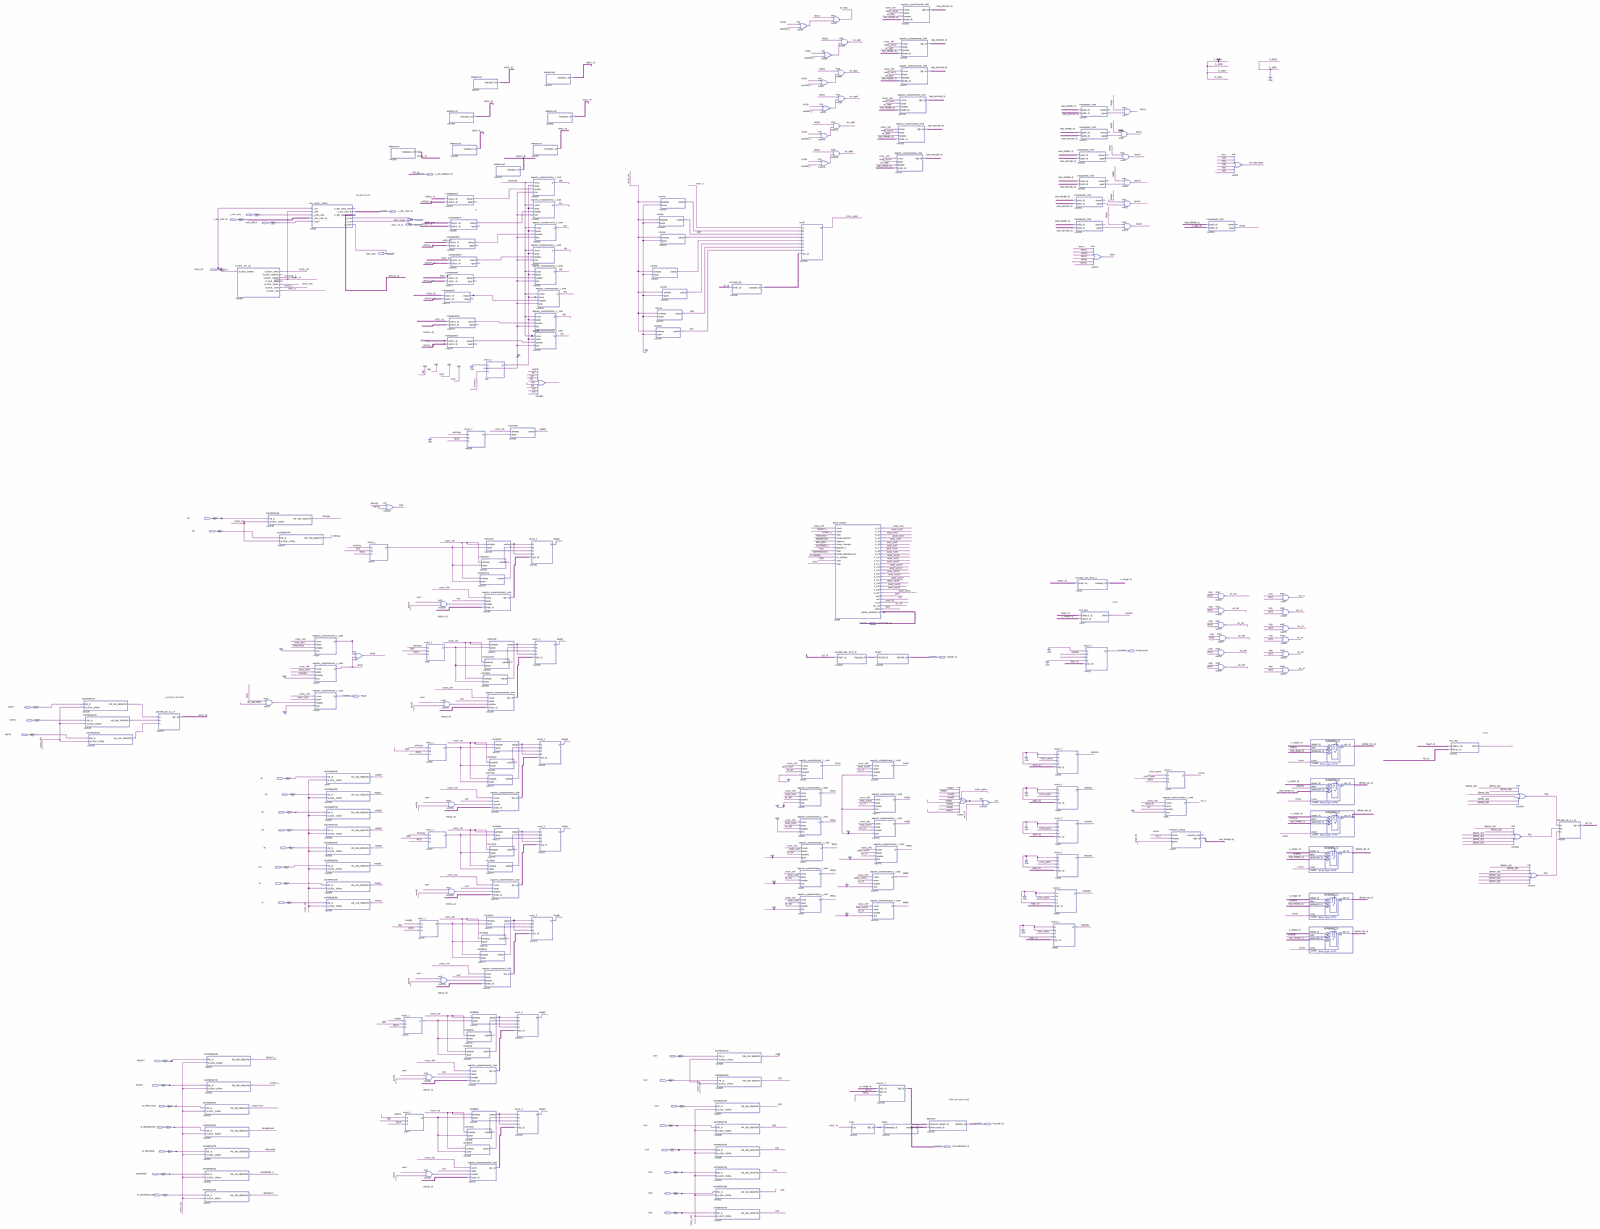
[diagram p0: schematic sheet, whole]
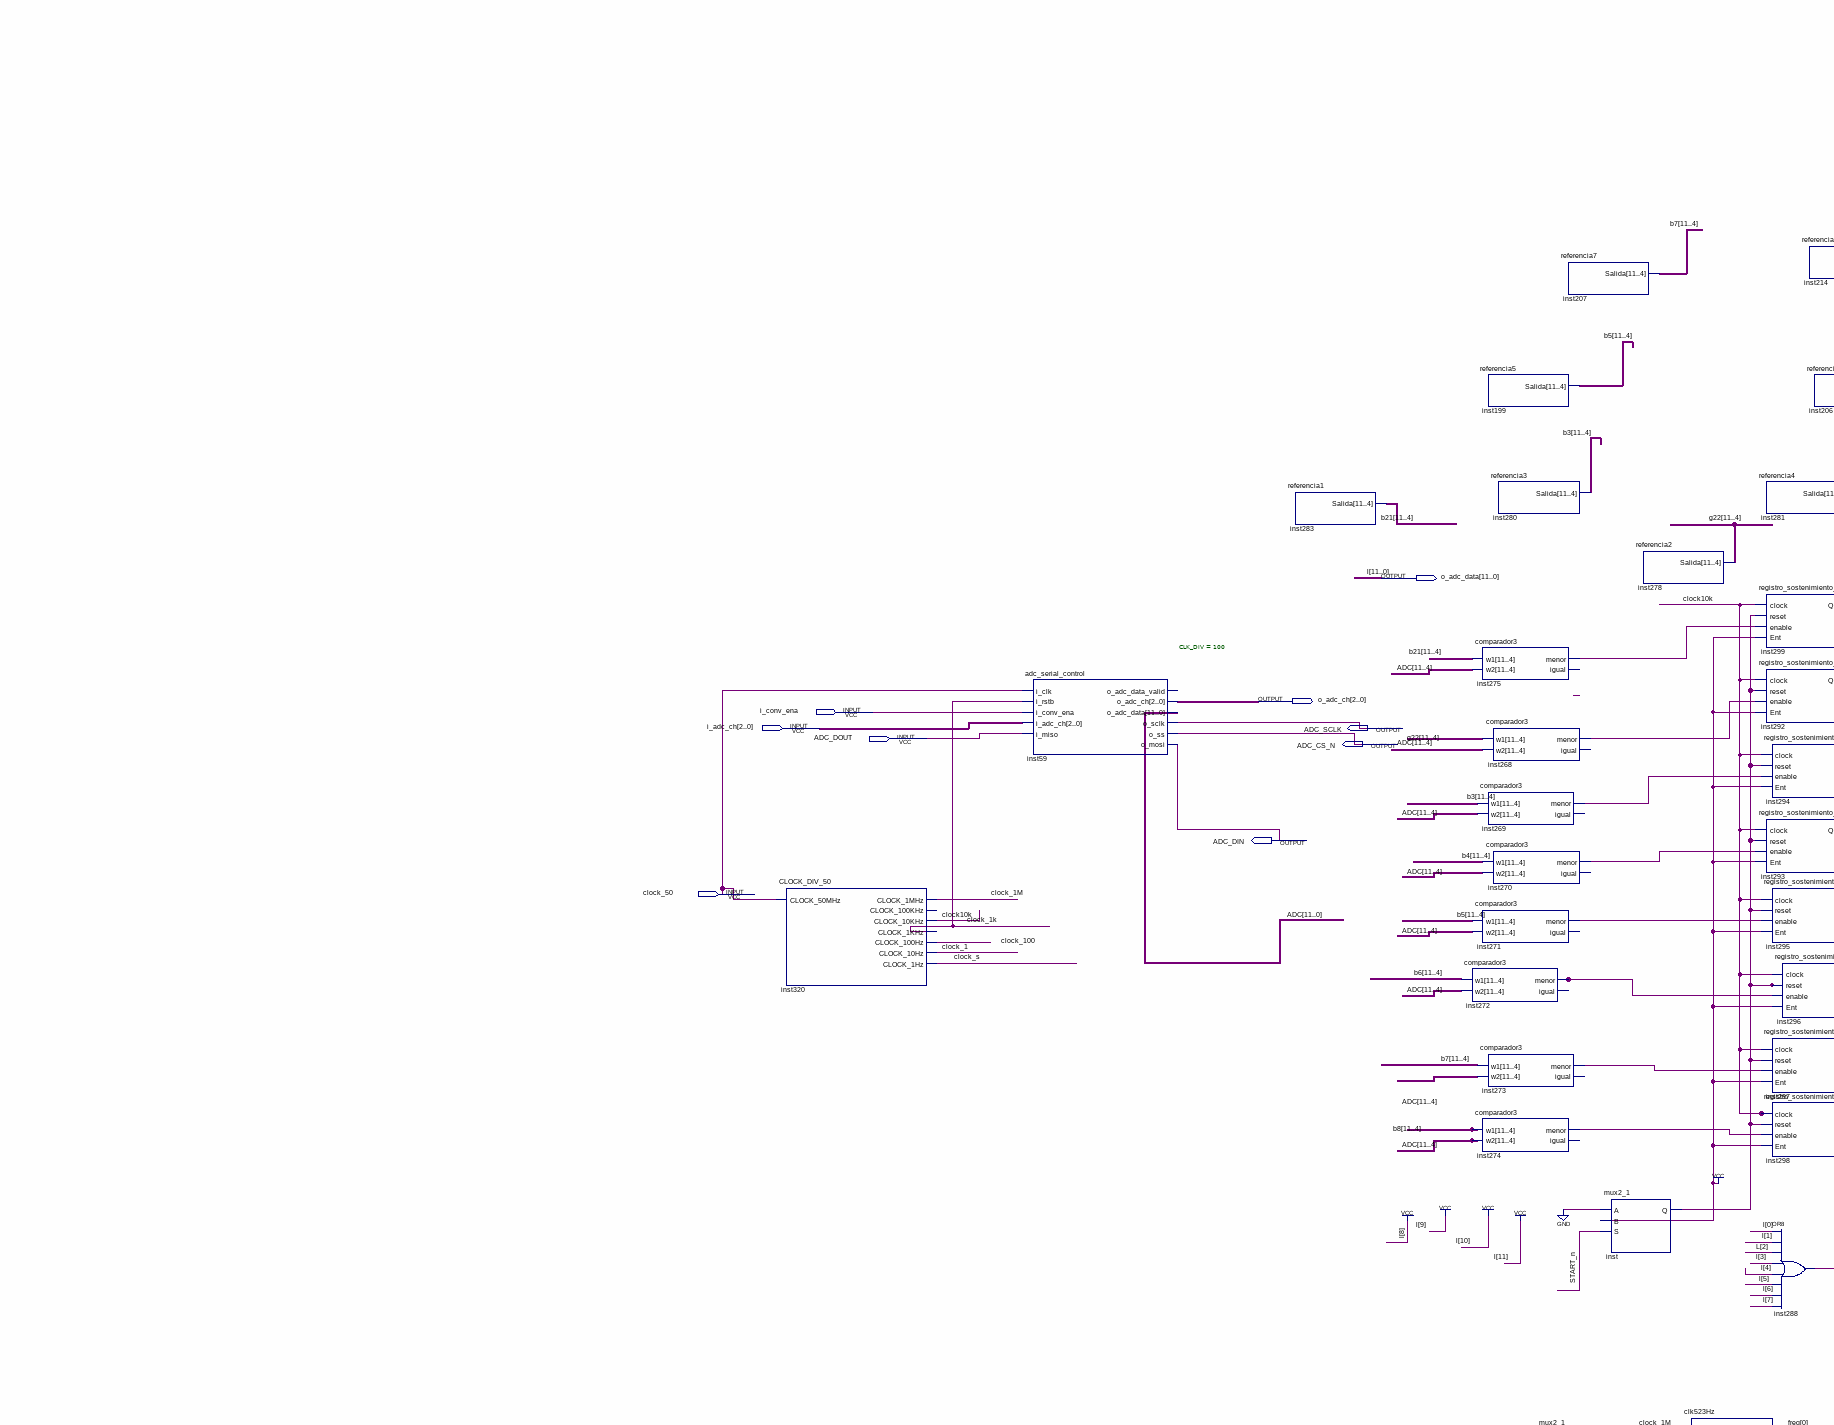
[diagram p1: schematic sheet, upper left part]
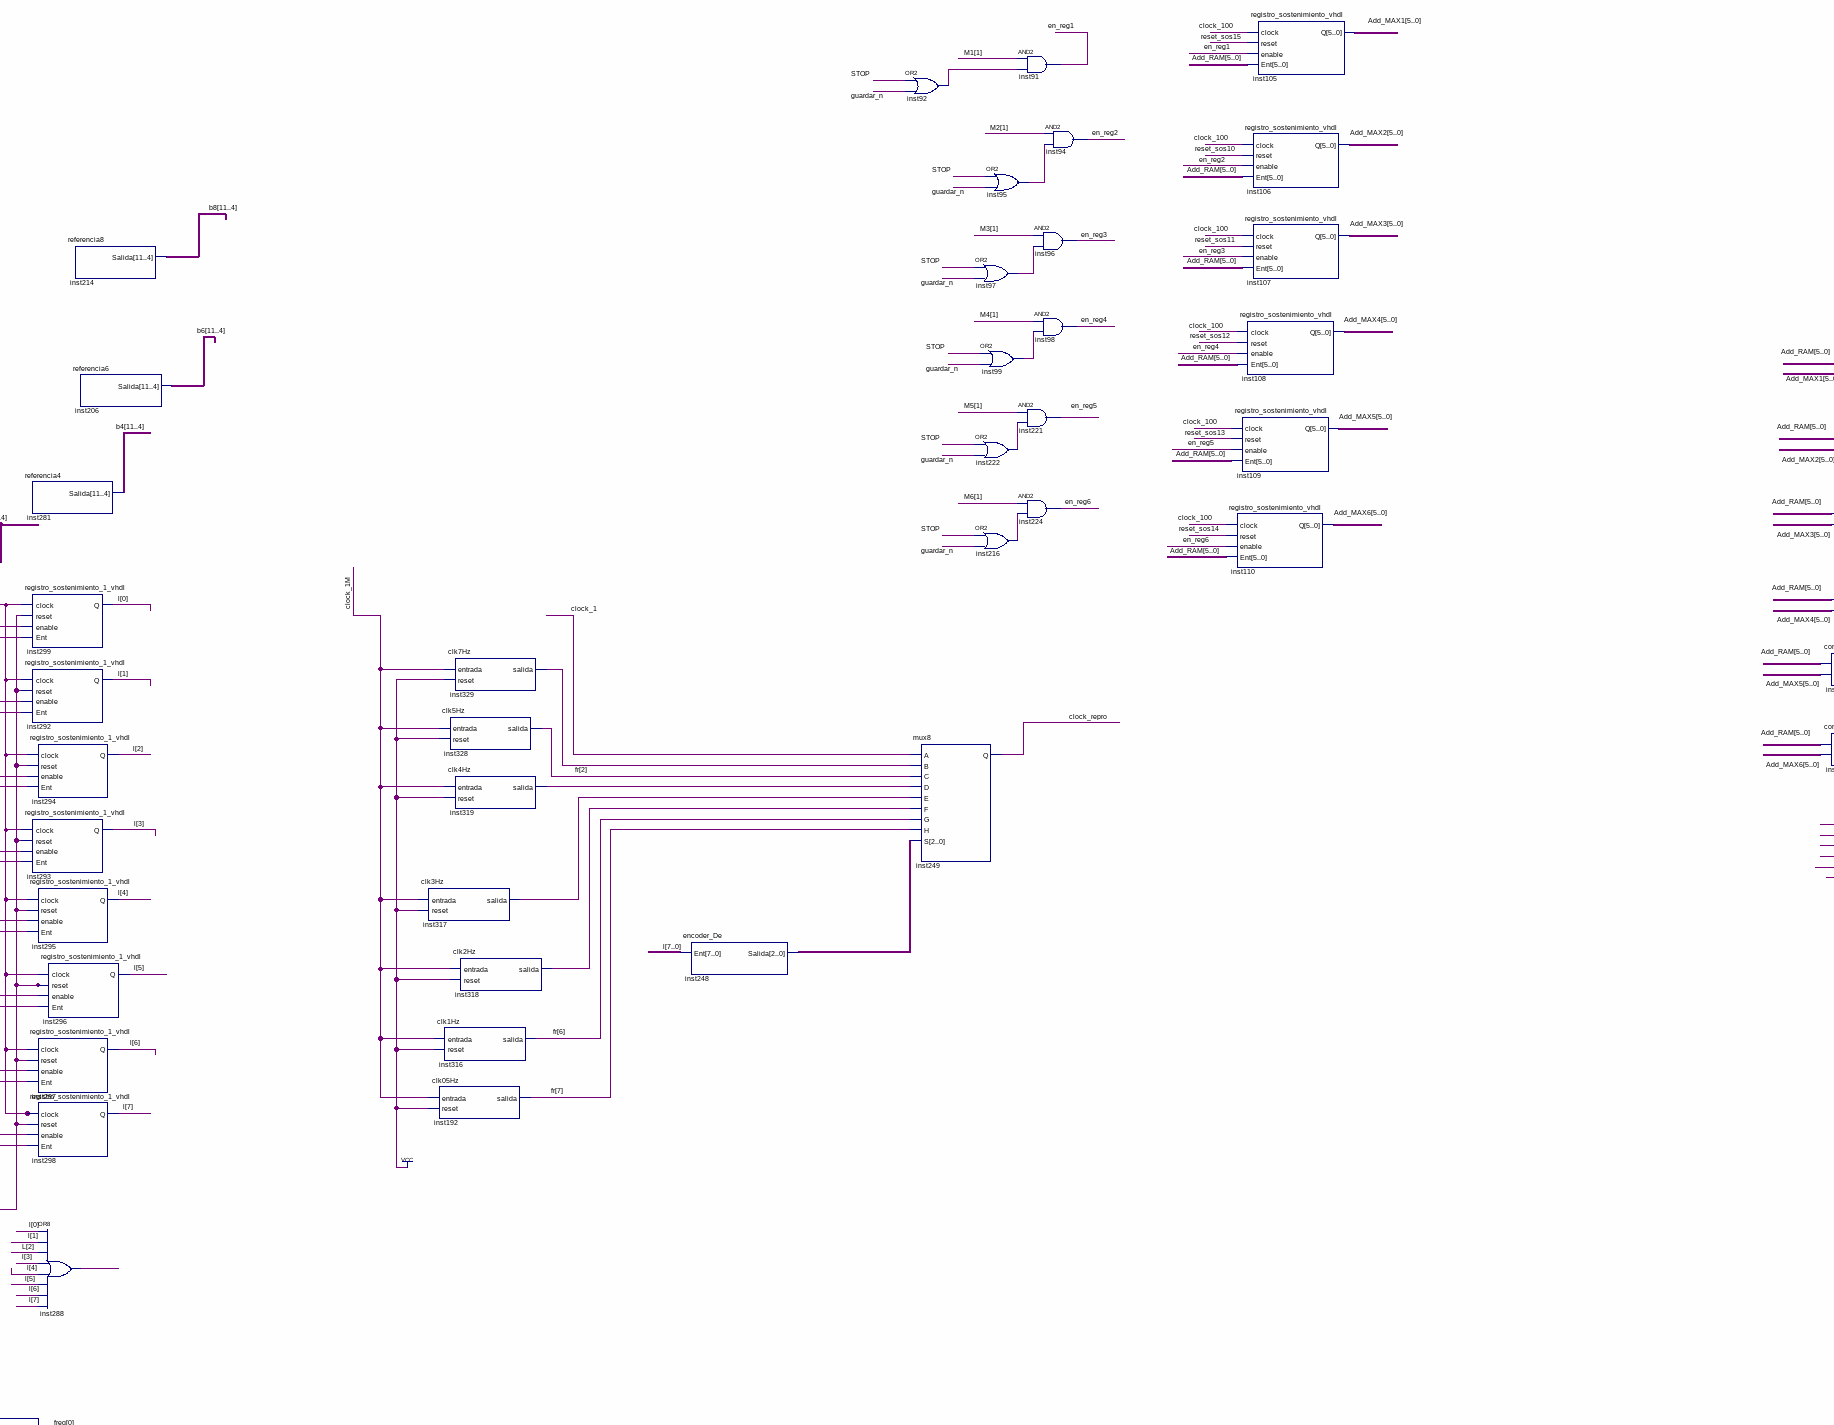
[diagram p2: schematic sheet, upper centre part]
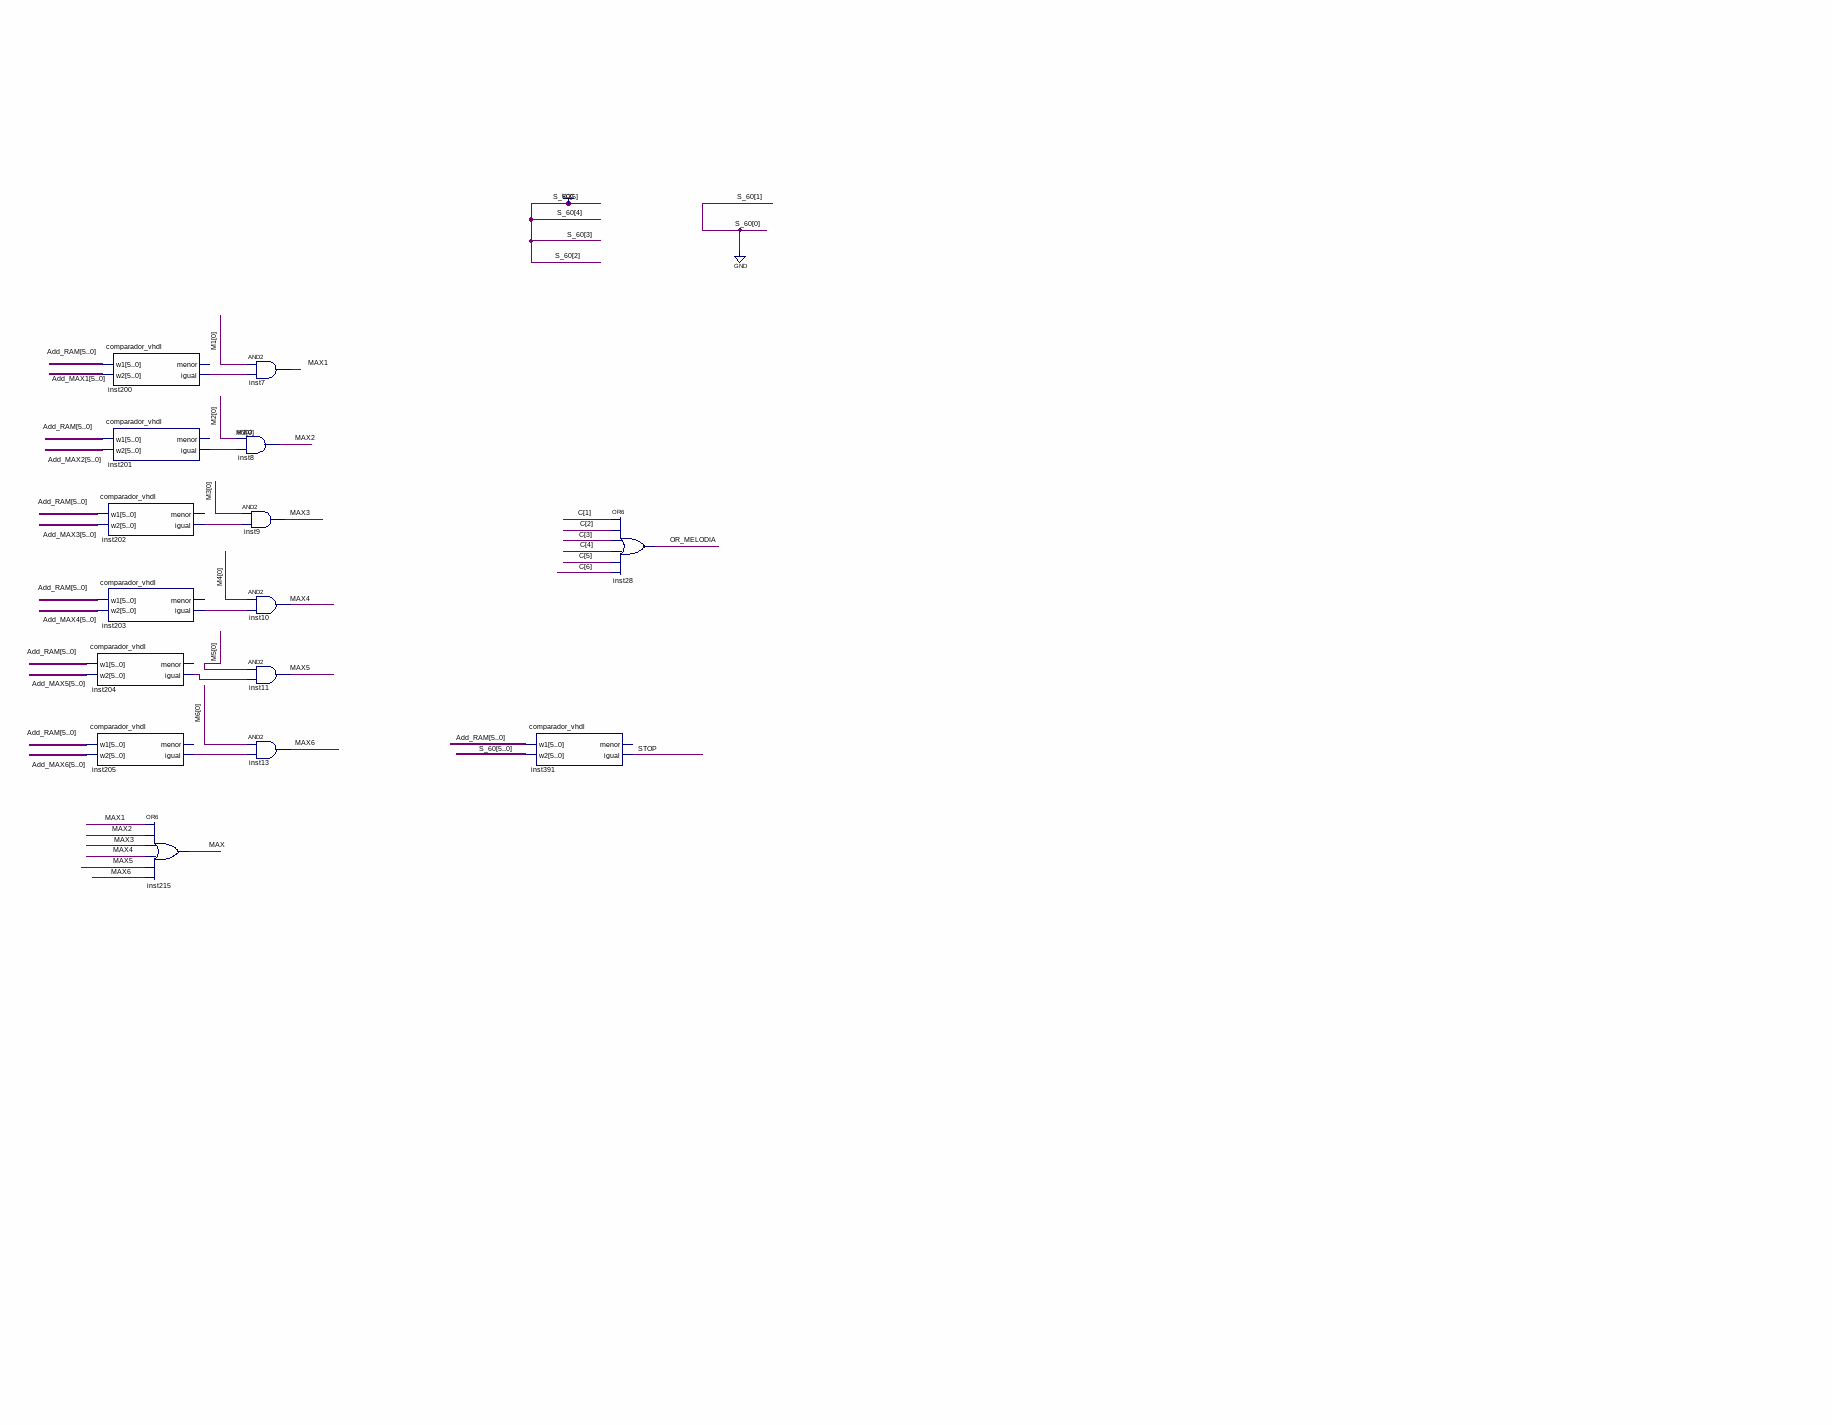
[diagram p3: schematic sheet, upper right part]
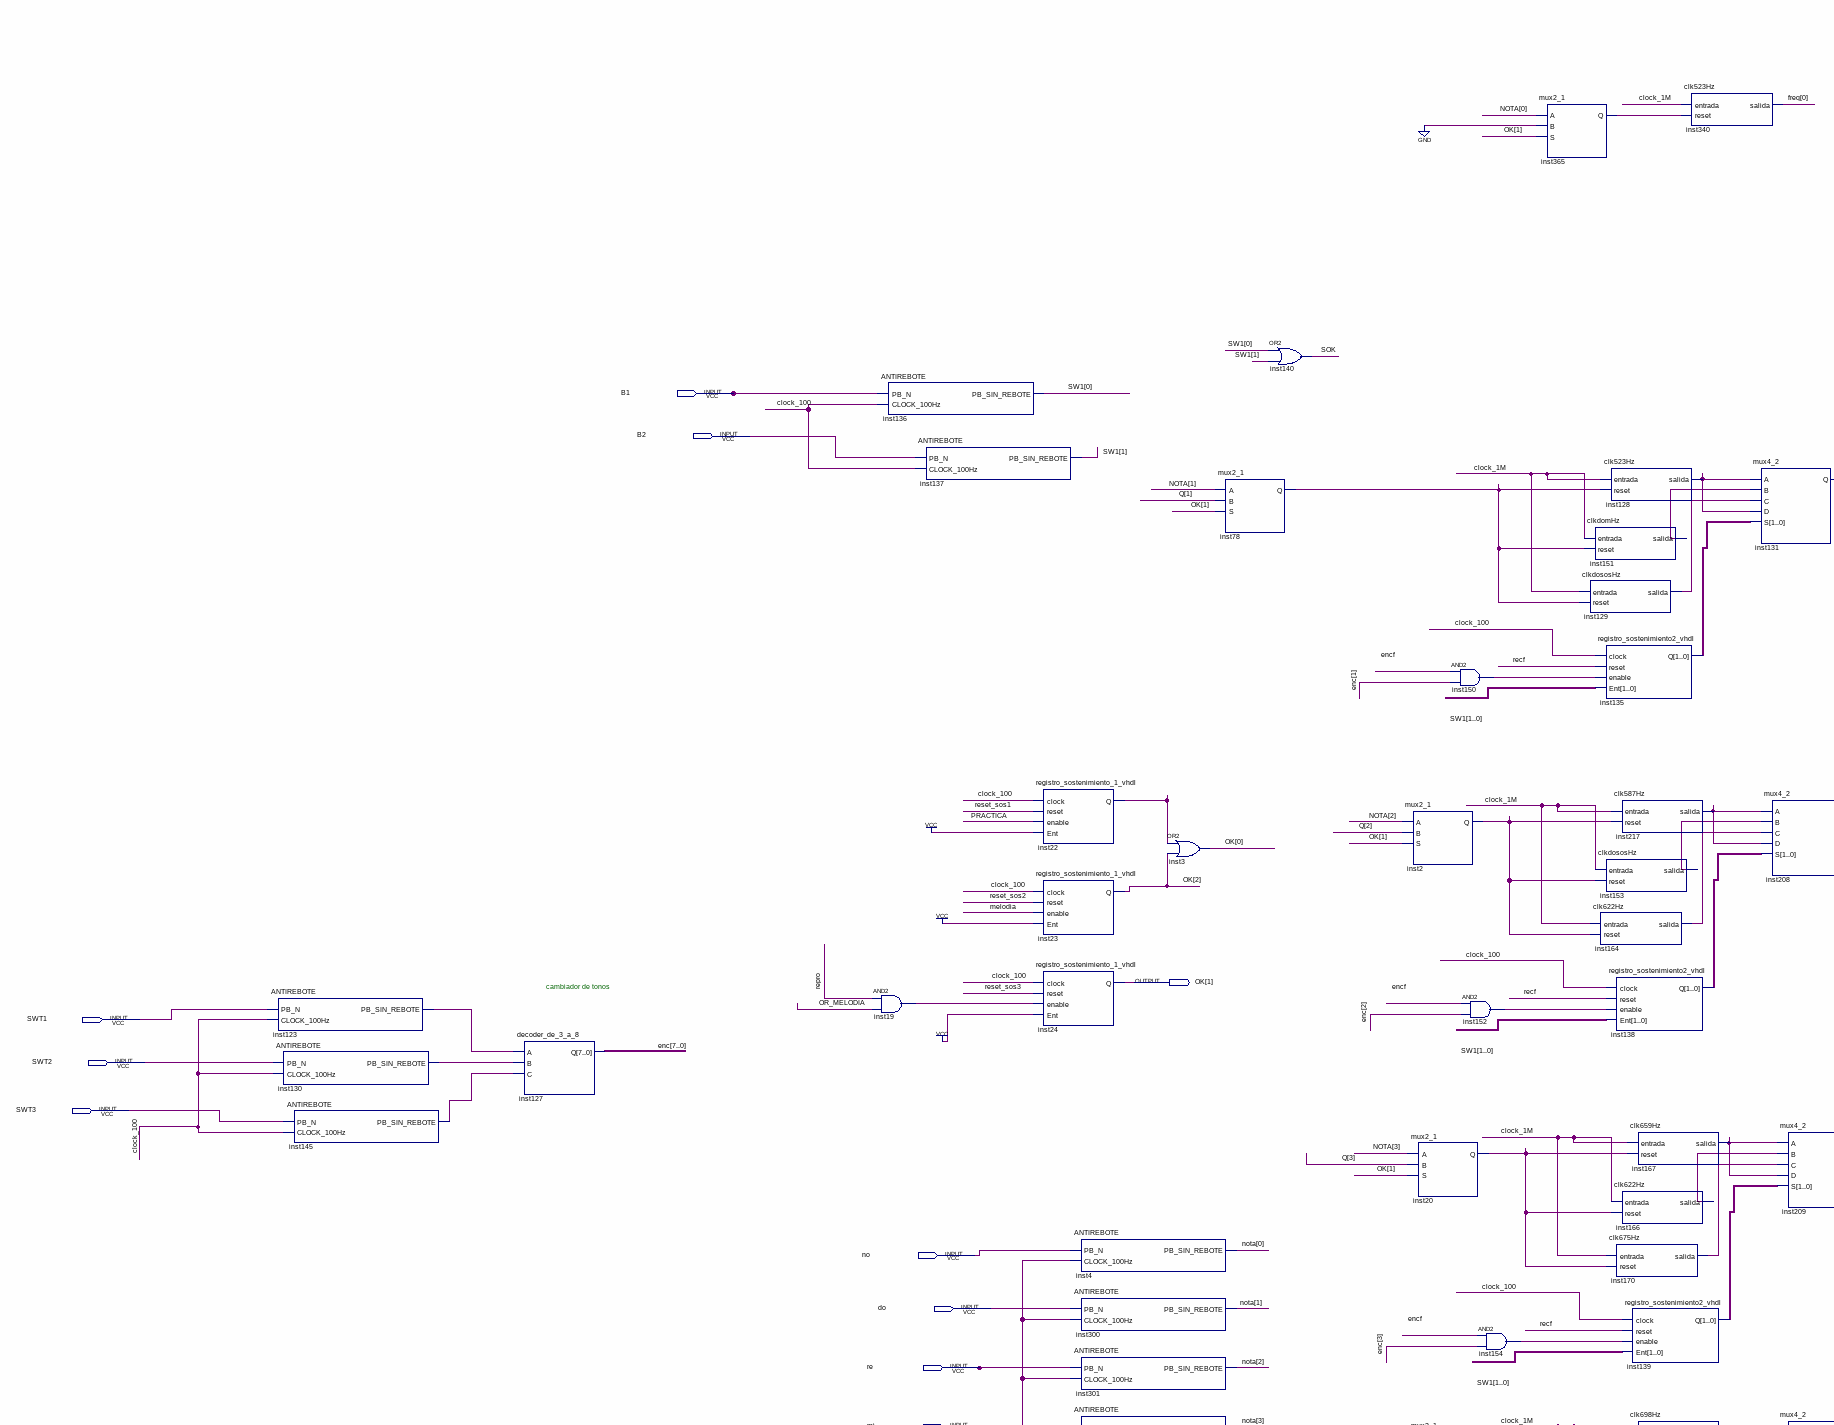
[diagram p4: schematic sheet, middle left part]
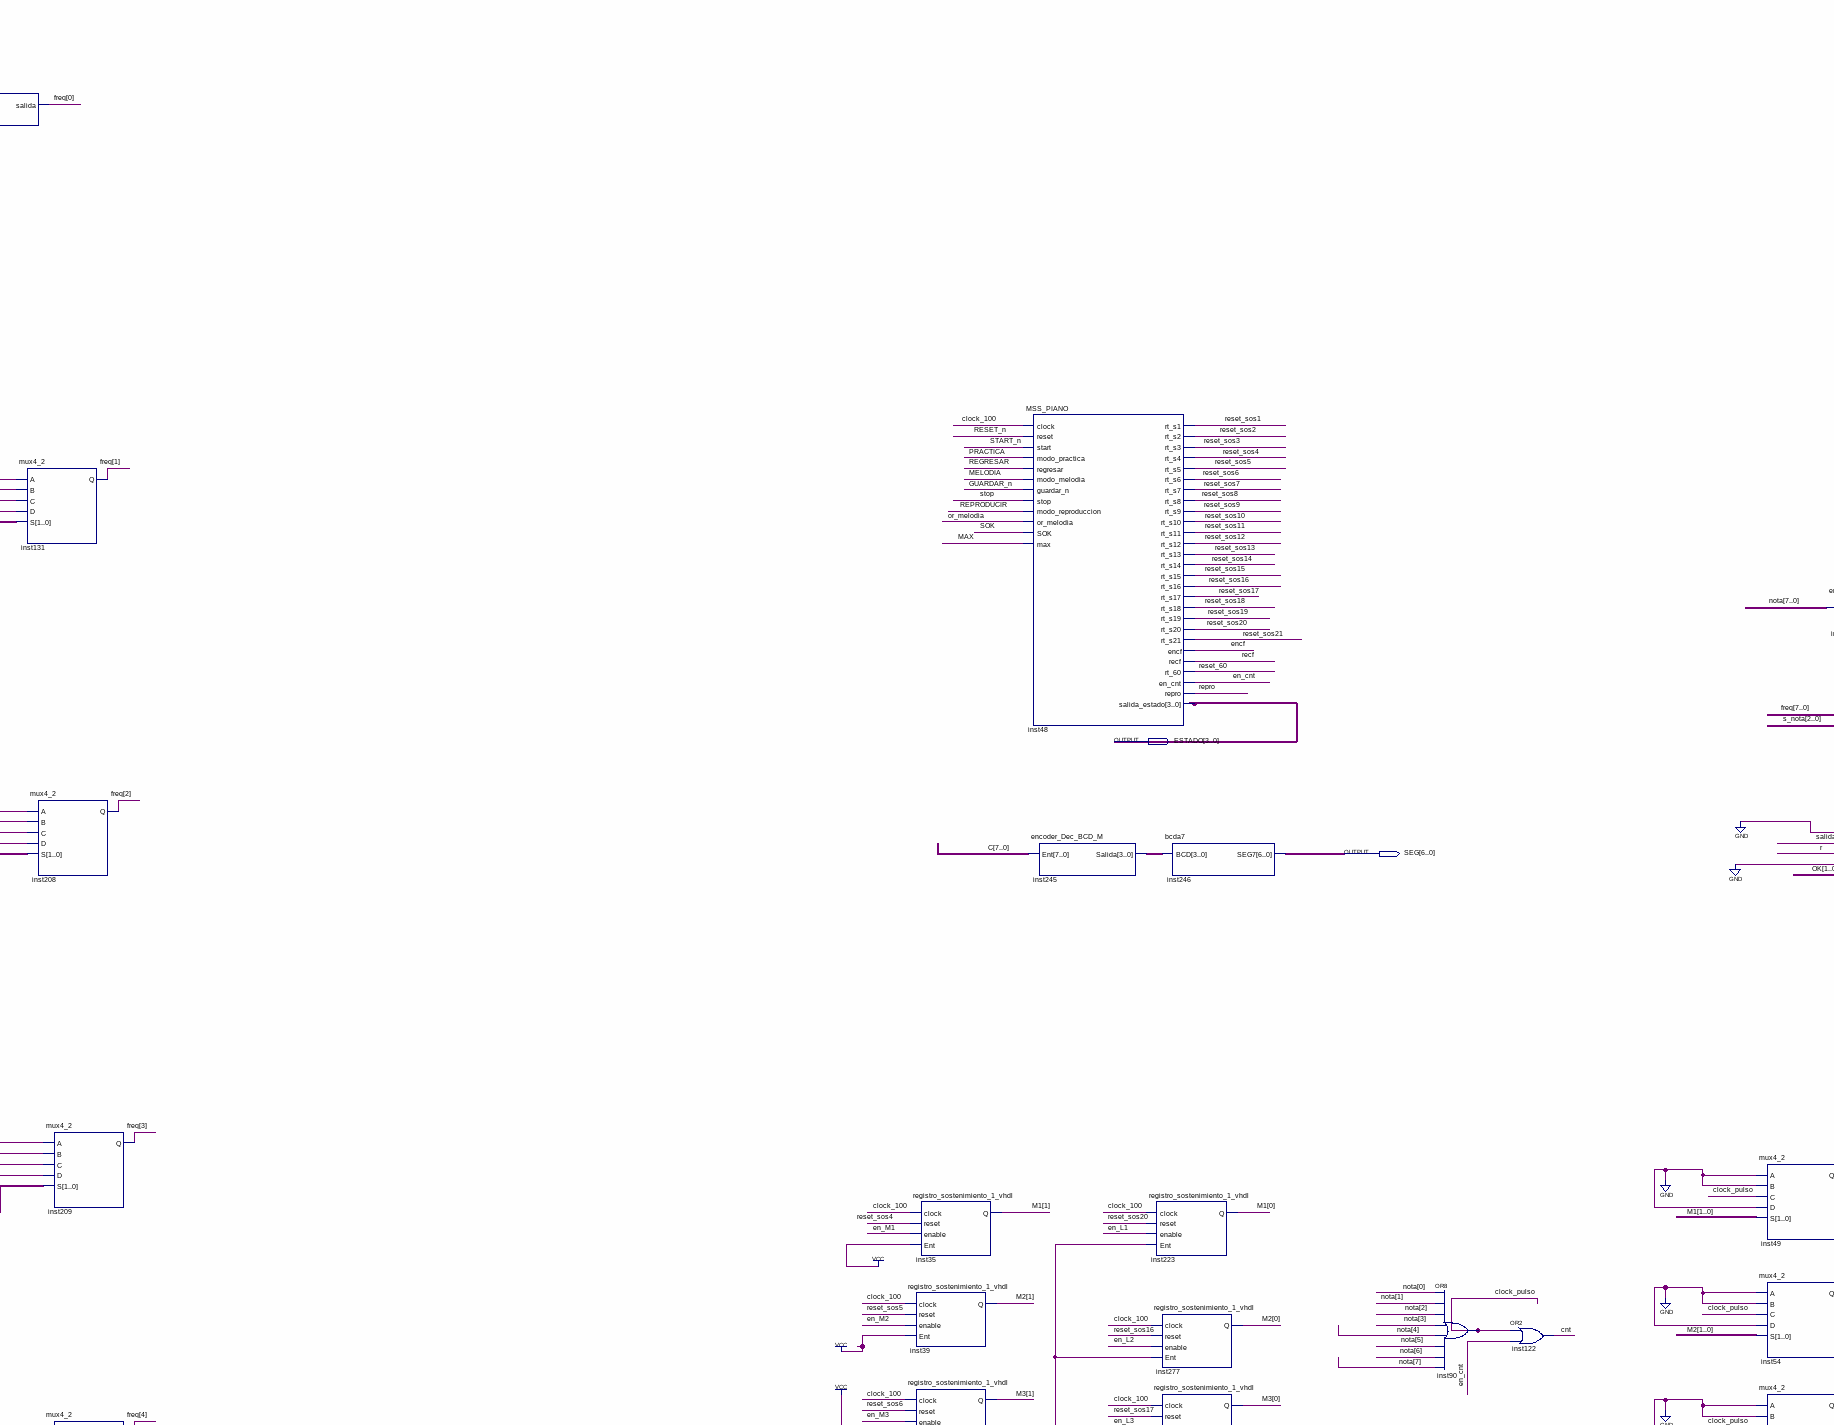
[diagram p5: schematic sheet, middle centre part]
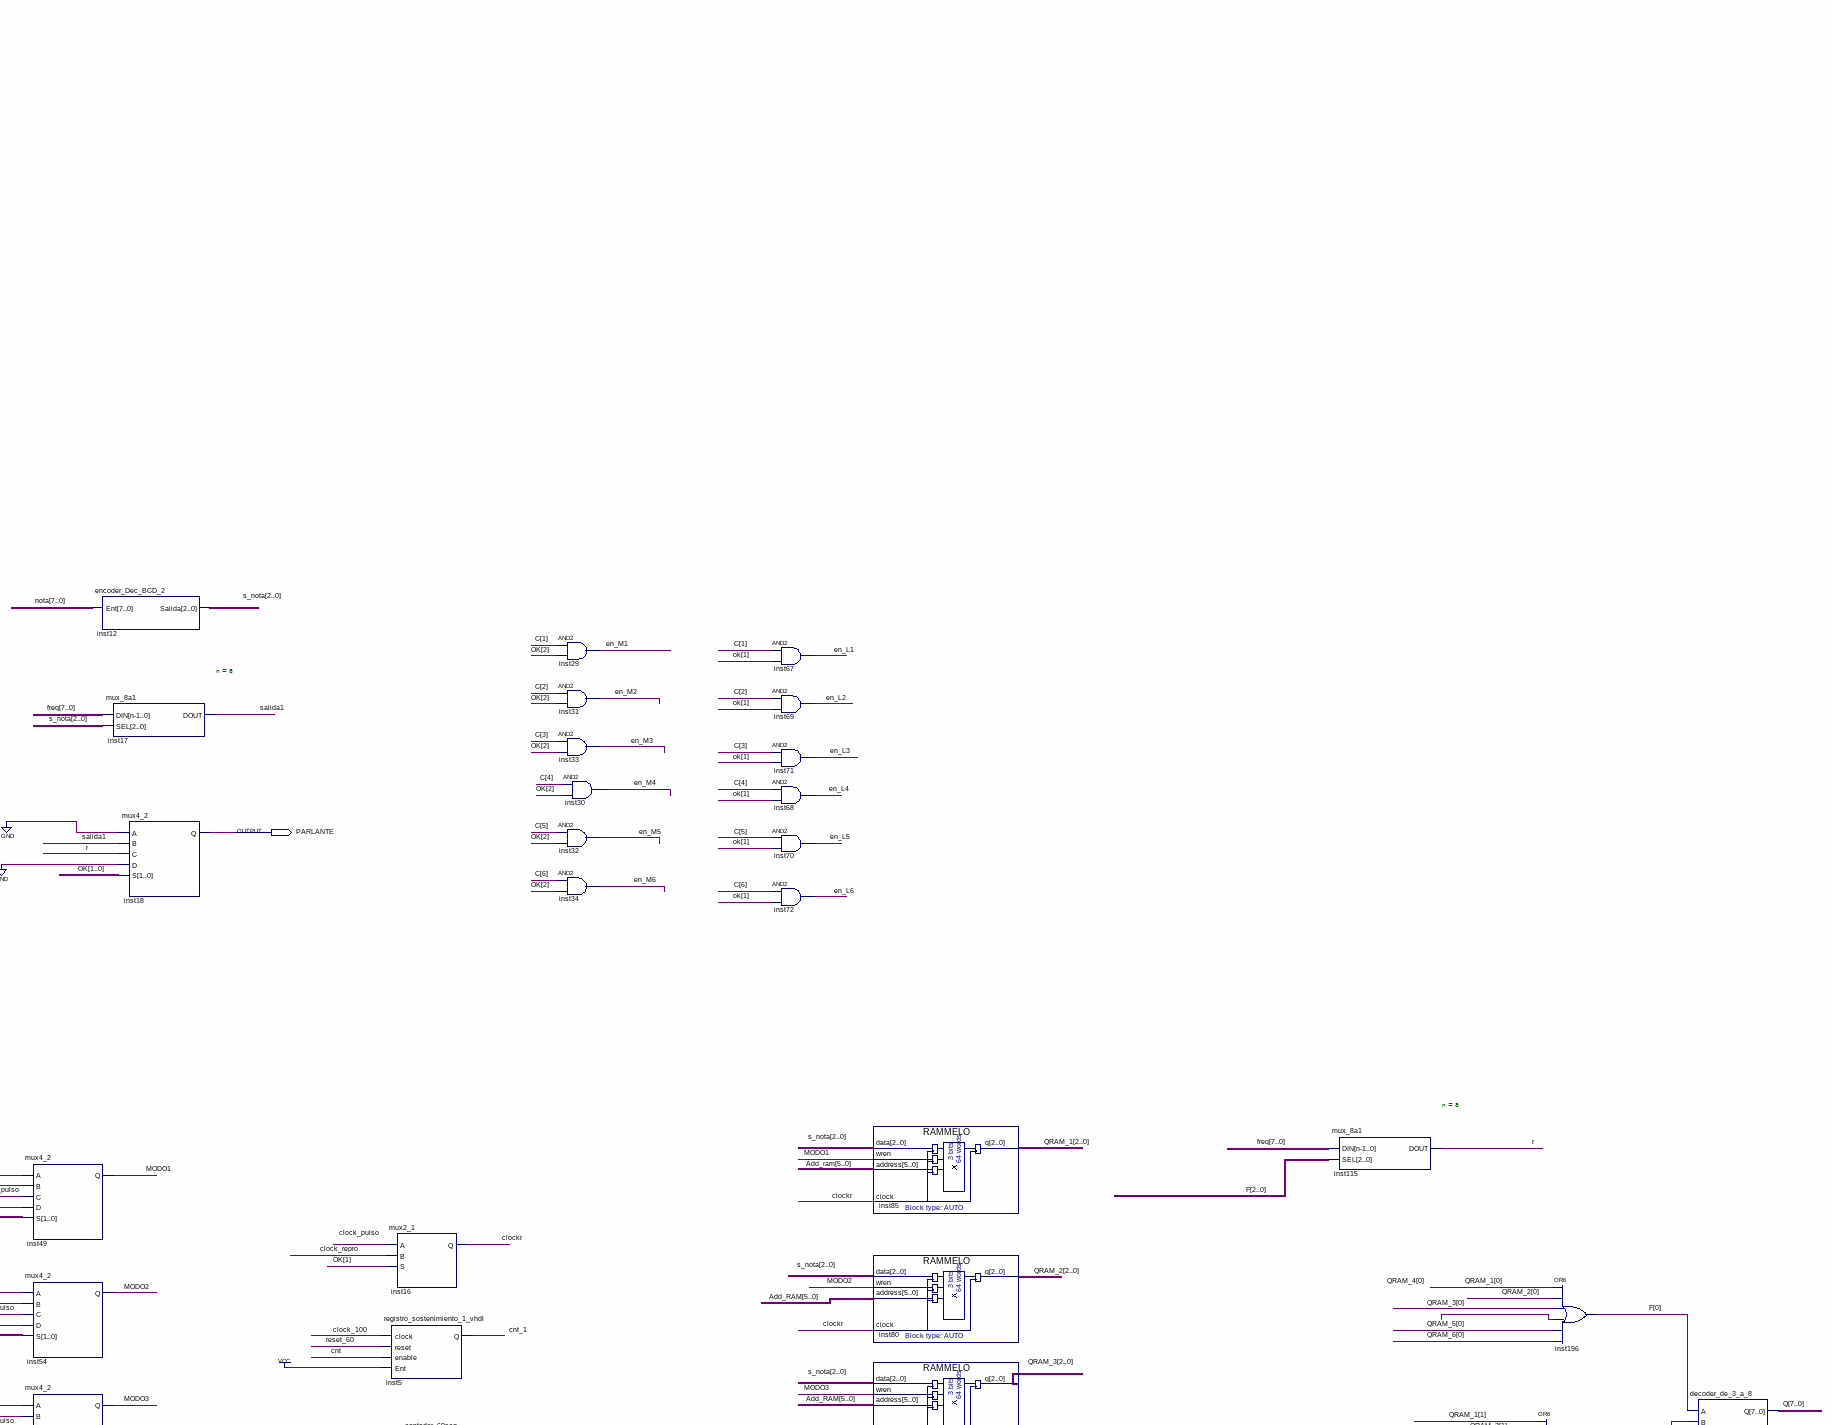
[diagram p6: schematic sheet, middle right part]
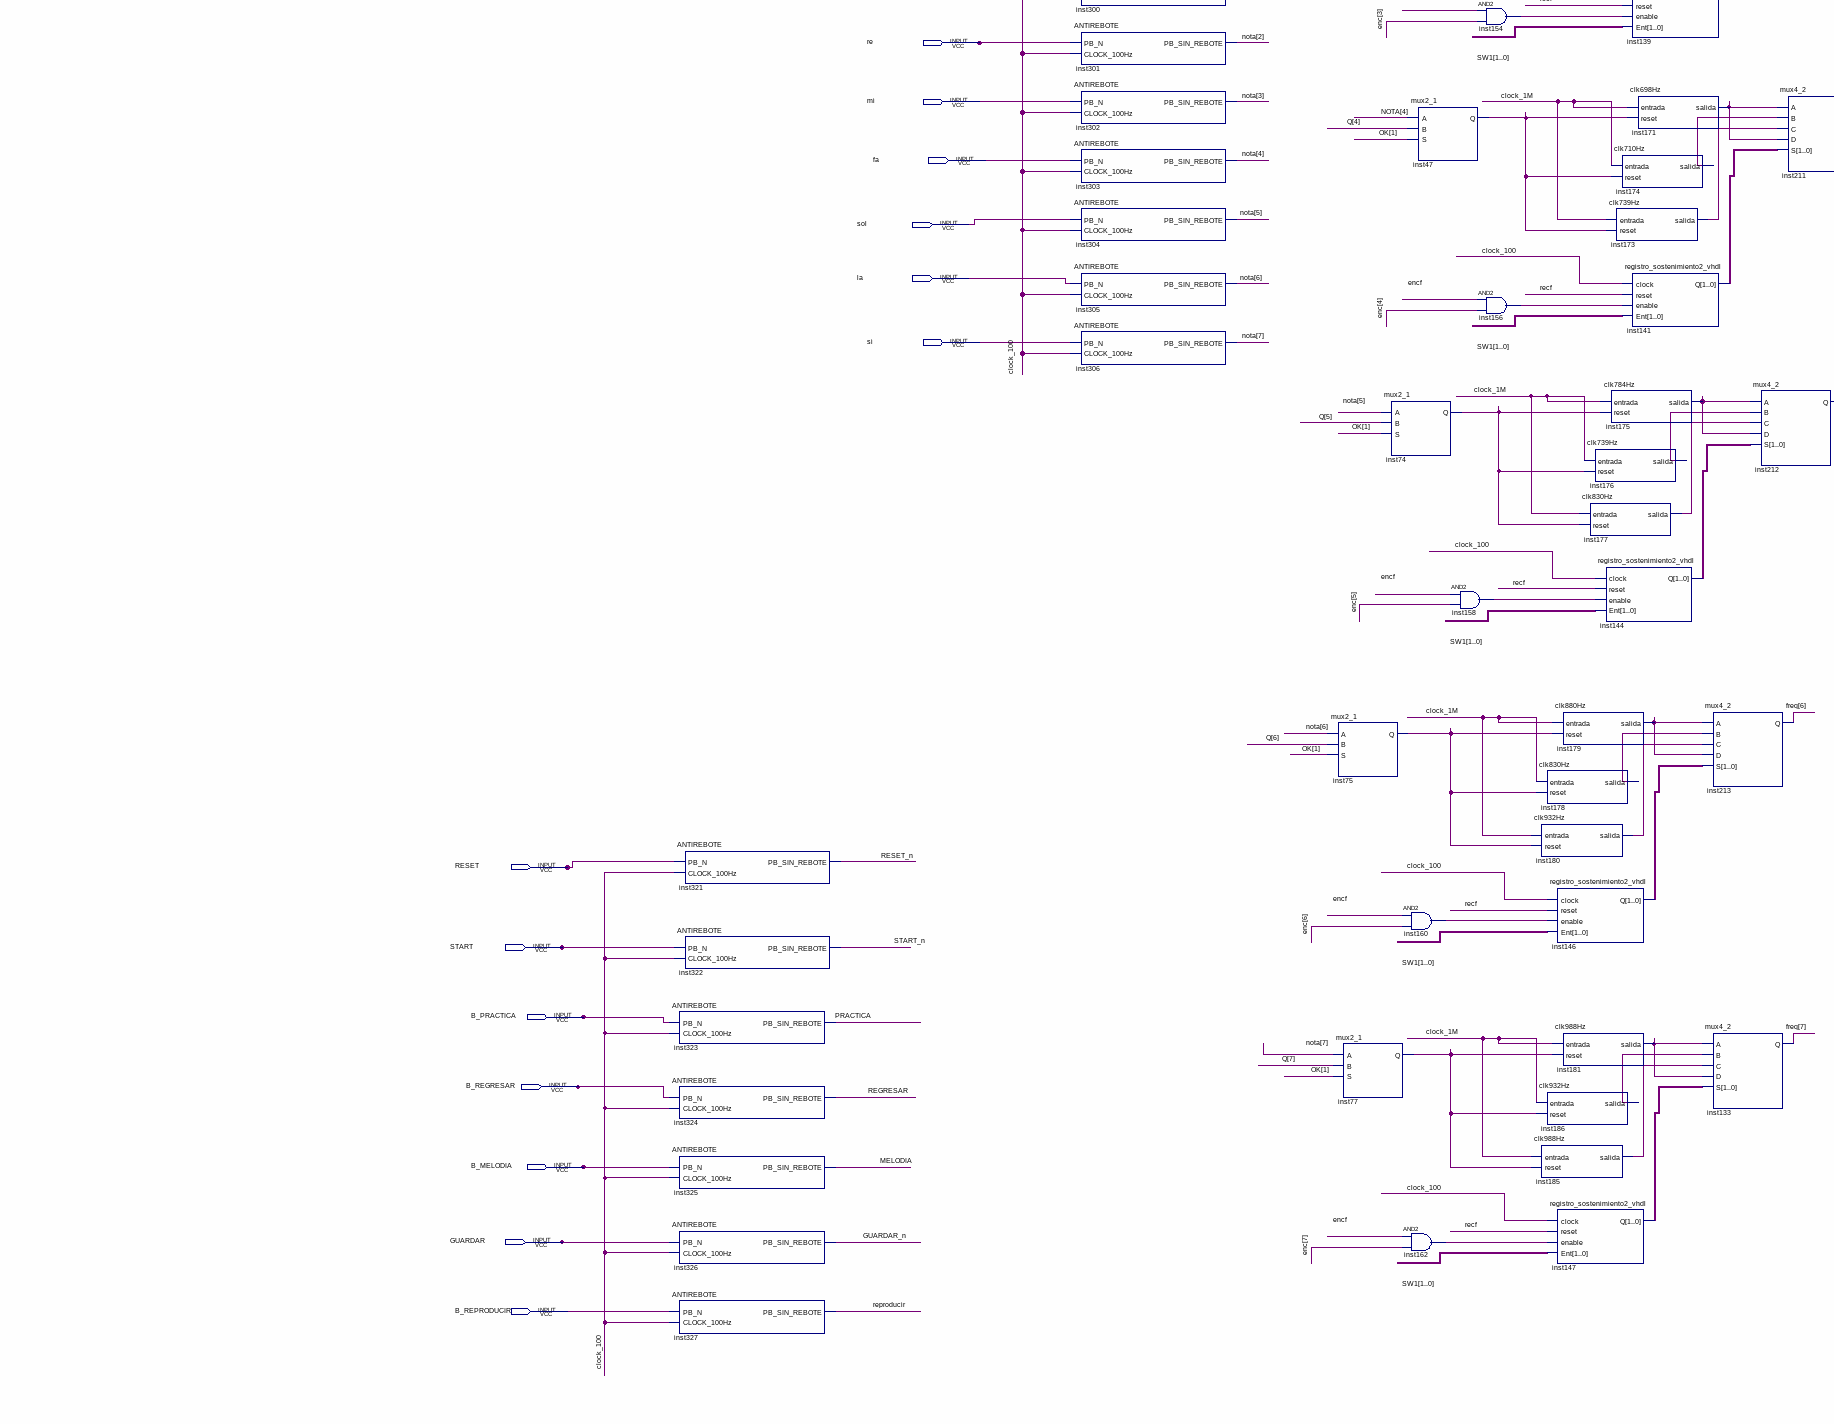
[diagram p7: schematic sheet, lower left part]
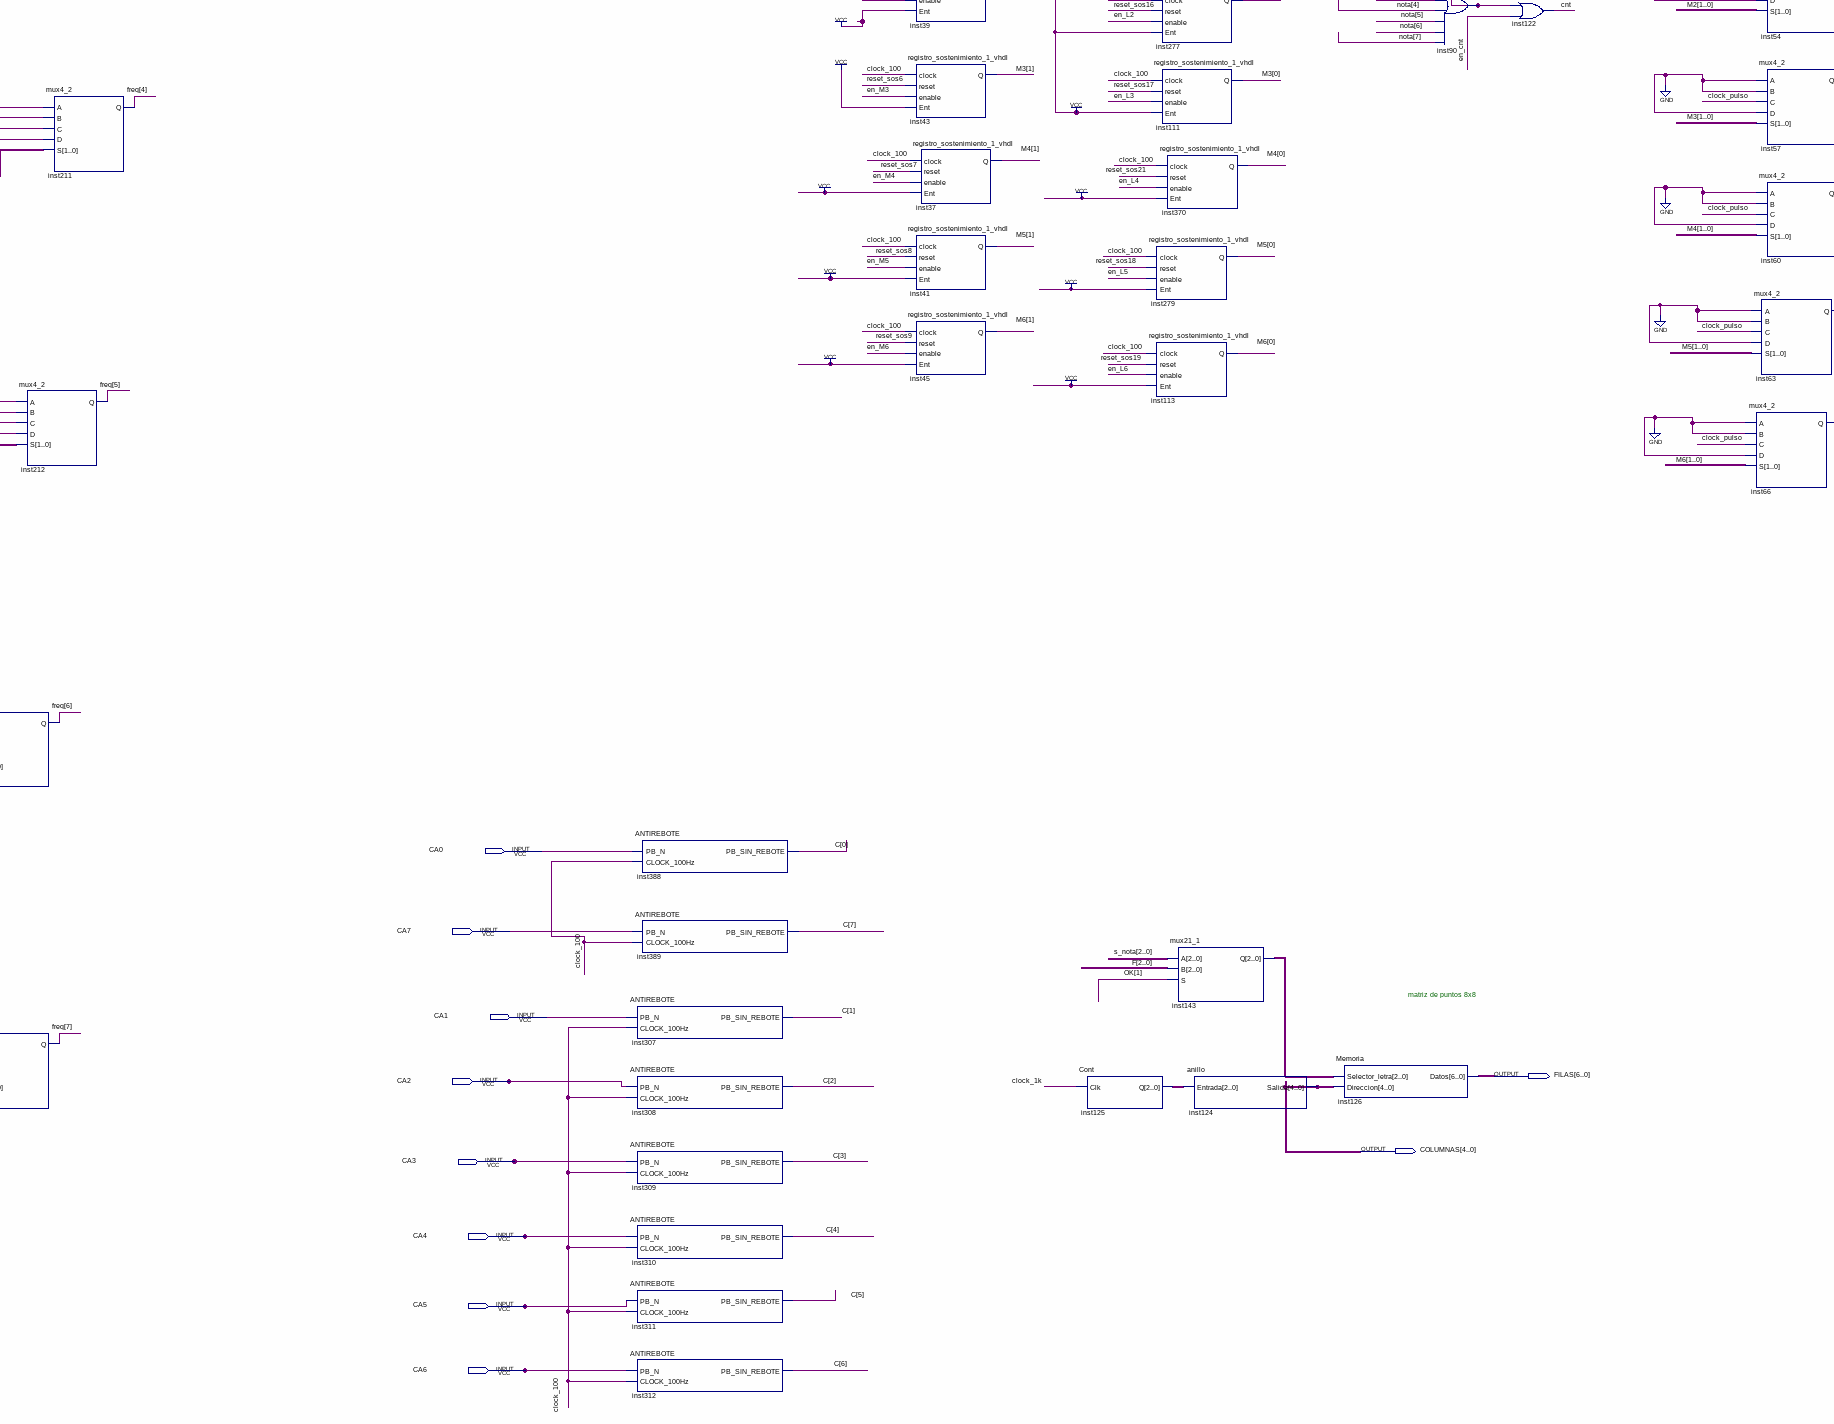
[diagram p8: schematic sheet, lower centre part]
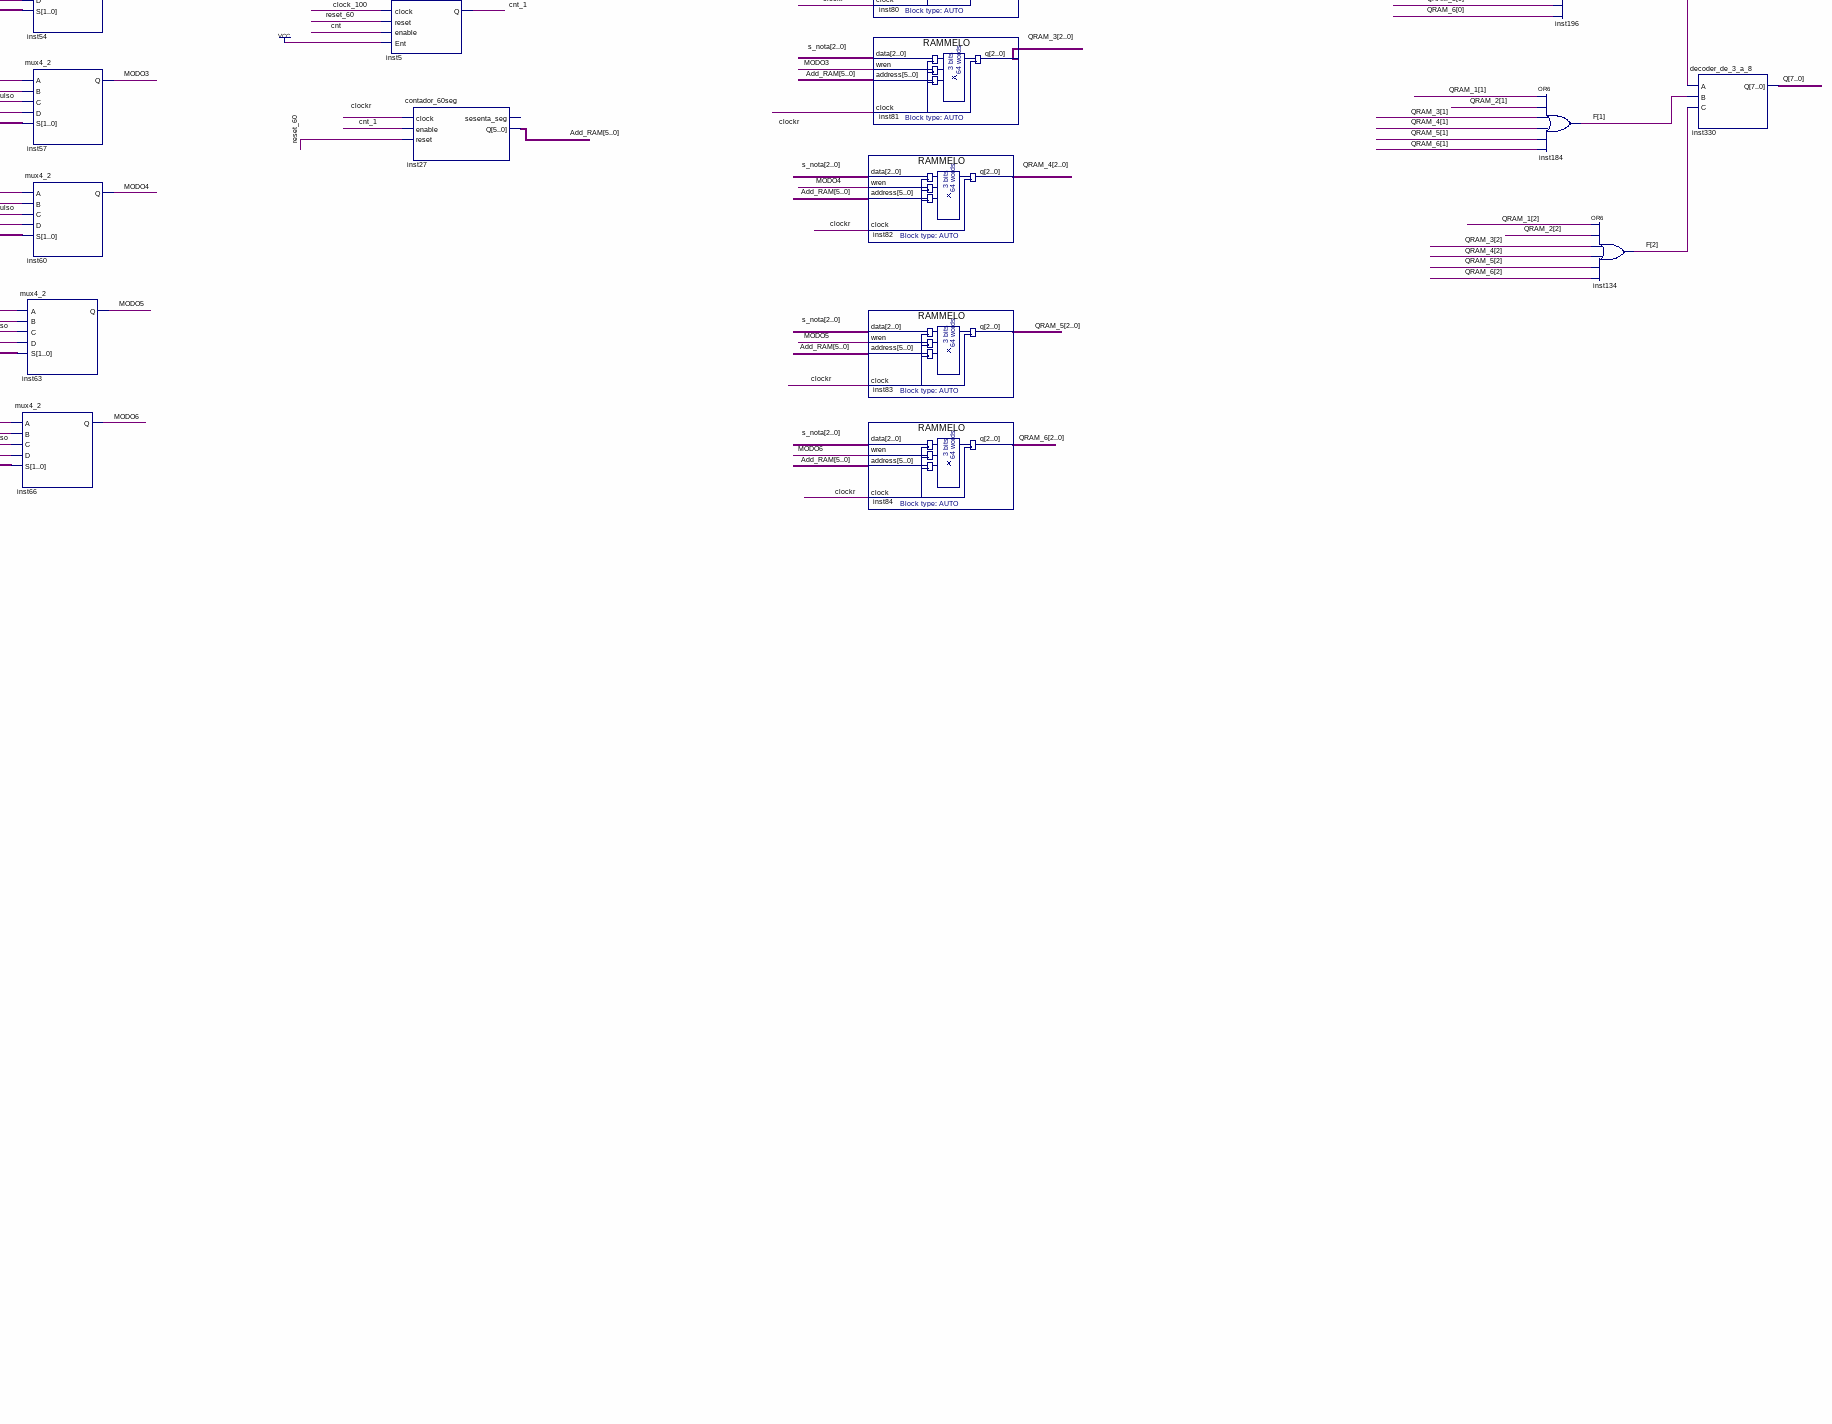
[diagram p9: schematic sheet, lower right part]
// Quartus schematic piano_ordenado_final2.bdf as structural Verilog: 212 symbols, 43 pins
module piano_ordenado_final2 (
  input  i_conv_ena,
  input  [2:0] i_adc_ch,
  input  ADC_DOUT,
  input  clock_50,
  input  B1,
  input  B2,
  input  SWT1,
  input  SWT2,
  input  SWT3,
  input  no,
  input  \do ,
  input  re,
  input  mi,
  input  fa,
  input  sol,
  input  la,
  input  si,
  input  CA0,
  input  RESET,
  input  CA7,
  input  START,
  input  B_PRACTICA,
  input  CA1,
  input  CA2,
  input  B_REGRESAR,
  input  CA3,
  input  B_MELODIA,
  input  CA4,
  input  GUARDAR,
  input  CA5,
  input  B_REPRODUCIR,
  input  CA6,
  output [11:0] o_adc_data,
  output [2:0] o_adc_ch,
  output ADC_SCLK,
  output ADC_CS_N,
  output ADC_DIN,
  output [3:0] ESTADO,
  output PARLANTE,
  output [6:0] SEG,
  output [2:0] OK,
  output [6:0] FILAS,
  output [4:0] COLUMNAS
);

  wire clock10k, clock_1, clock_1k, clock_1M, clock_100, clock_pulso, clock_repro, clock_s, clockr, cnt,
       cnt_1, en_cnt, en_L1, en_L2, en_L3, en_L4, en_L5, en_L6, en_M1, en_M2, en_M3, en_M4, en_M5, en_M6,
       en_reg1, en_reg2, en_reg3, en_reg4, en_reg5, en_reg6, encf, GUARDAR_n, inst2_q, inst19_out, inst20_q,
       inst22_q, inst47_q, inst74_q, inst75_q, inst77_q, inst78_q, inst92_out, inst95_out, inst97_out,
       inst99_out, inst123_pb_sin_rebote, inst128_salida, inst129_salida, inst130_pb_sin_rebote,
       inst145_pb_sin_rebote, inst150_out, inst151_salida, inst152_out, inst153_salida, inst154_out,
       inst156_out, inst158_out, inst160_out, inst162_out, inst164_salida, inst166_salida, inst167_salida,
       inst170_salida, inst171_salida, inst173_salida, inst174_salida, inst175_salida, inst176_salida,
       inst177_salida, inst178_salida, inst179_salida, inst180_salida, inst181_salida, inst185_salida,
       inst186_salida, inst200_igual, inst201_igual, inst202_igual, inst203_igual, inst204_igual,
       inst205_igual, inst216_out, inst217_salida, inst222_out, inst268_menor, inst269_menor, inst270_menor,
       inst271_menor, inst272_menor, inst273_menor, inst274_menor, inst275_menor, inst288_out,
       inst317_salida, inst318_salida, inst319_salida, inst329_salida, inst365_q, inst_q, MAX, MAX1, MAX2,
       MAX3, MAX4, MAX5, MAX6, melodia, MODO1, MODO2, MODO3, MODO4, MODO5, MODO6, OR_MELODIA, PRACTICA, r,
       recf, REGRESAR, repro, reproducir, reset_60, RESET_n, reset_sos1, reset_sos2, reset_sos3, reset_sos4,
       reset_sos5, reset_sos6, reset_sos7, reset_sos8, reset_sos9, reset_sos10, reset_sos11, reset_sos12,
       reset_sos13, reset_sos14, reset_sos15, reset_sos16, reset_sos17, reset_sos18, reset_sos19,
       reset_sos20, reset_sos21, salida1, SOK, START_n, STOP;
  wire [1:0] inst135_q, inst138_q, inst139_q, inst141_q, inst144_q, inst146_q, inst147_q, M1, M2, M3, M4, M5,
       M6, SW1;
  wire [2:0] F, inst125_q, inst143_q, inst248_salida, QRAM_1, QRAM_2, QRAM_3, QRAM_4, QRAM_5, QRAM_6, s_nota;
  wire [3:0] inst245_salida;
  wire [5:0] Add_MAX1, Add_MAX2, Add_MAX3, Add_MAX4, Add_MAX5, Add_MAX6, Add_RAM;
  wire [7:0] C, enc, freq, nota, Q;
  wire [7:2] fr;
  wire [11:0] ADC;
  wire [11:4] b3, b4, b5, b6, b7, b8, b21, g22;

  ANTIREBOTE inst123 (.PB_N(SWT1), .CLOCK_100Hz(clock_100), .PB_SIN_REBOTE(inst123_pb_sin_rebote));
  ANTIREBOTE inst130 (.PB_N(SWT2), .CLOCK_100Hz(clock_100), .PB_SIN_REBOTE(inst130_pb_sin_rebote));
  ANTIREBOTE inst145 (.PB_N(SWT3), .CLOCK_100Hz(clock_100), .PB_SIN_REBOTE(inst145_pb_sin_rebote));
  decoder_de_3_a_8 inst127 (.A(inst123_pb_sin_rebote), .B(inst130_pb_sin_rebote), .C(inst145_pb_sin_rebote), .Q(enc));
  ANTIREBOTE inst321 (.PB_N(RESET), .CLOCK_100Hz(clock_100), .PB_SIN_REBOTE(RESET_n));
  ANTIREBOTE inst322 (.PB_N(START), .CLOCK_100Hz(clock_100), .PB_SIN_REBOTE(START_n));
  ANTIREBOTE inst323 (.PB_N(B_PRACTICA), .CLOCK_100Hz(clock_100), .PB_SIN_REBOTE(PRACTICA));
  ANTIREBOTE inst324 (.PB_N(B_REGRESAR), .CLOCK_100Hz(clock_100), .PB_SIN_REBOTE(REGRESAR));
  ANTIREBOTE inst325 (.PB_N(B_MELODIA), .CLOCK_100Hz(clock_100), .PB_SIN_REBOTE(melodia));
  ANTIREBOTE inst326 (.PB_N(GUARDAR), .CLOCK_100Hz(clock_100), .PB_SIN_REBOTE(GUARDAR_n));
  ANTIREBOTE inst327 (.PB_N(B_REPRODUCIR), .CLOCK_100Hz(clock_100), .PB_SIN_REBOTE(reproducir));
  CLOCK_DIV_50 inst320 (
    .CLOCK_50MHz(clock_50), .CLOCK_1MHz(clock_1M), .CLOCK_10KHz(clock10k), .CLOCK_1KHz(clock_1k),
    .CLOCK_100Hz(clock_100), .CLOCK_10Hz(clock_1), .CLOCK_1Hz(clock_s));  // open: CLOCK_100KHz
  ANTIREBOTE inst136 (.PB_N(B1), .CLOCK_100Hz(clock_100), .PB_SIN_REBOTE(SW1[0]));
  and inst19 (inst19_out, repro, OR_MELODIA);
  ANTIREBOTE inst137 (.PB_N(B2), .CLOCK_100Hz(clock_100), .PB_SIN_REBOTE(SW1[1]));
  adc_serial_control #(.CLK_DIV(100)) inst59 (
    .i_clk(clock_50), .i_rstb(clock_1k), .i_conv_ena(i_conv_ena), .i_adc_ch(i_adc_ch), .i_miso(ADC_DOUT),
    .o_adc_ch(o_adc_ch), .o_adc_data(ADC), .o_sclk(ADC_SCLK), .o_ss(ADC_CS_N), .o_mosi(ADC_DIN));  // open: o_adc_data_valid
  registro_sostenimiento_1_vhdl inst22 (
    .clock(clock_100), .reset(reset_sos1), .enable(PRACTICA), .Ent(1'b1), .Q(inst22_q));
  registro_sostenimiento_1_vhdl inst23 (.clock(clock_100), .reset(reset_sos2), .enable(melodia), .Ent(1'b1), .Q(OK[2]));
  registro_sostenimiento_1_vhdl inst24 (
    .clock(clock_100), .reset(reset_sos3), .enable(inst19_out), .Ent(1'b1), .Q(OK[1]));
  ANTIREBOTE inst4 (.PB_N(no), .CLOCK_100Hz(clock_100), .PB_SIN_REBOTE(nota[0]));
  ANTIREBOTE inst300 (.PB_N(\do ), .CLOCK_100Hz(clock_100), .PB_SIN_REBOTE(nota[1]));
  ANTIREBOTE inst301 (.PB_N(re), .CLOCK_100Hz(clock_100), .PB_SIN_REBOTE(nota[2]));
  ANTIREBOTE inst302 (.PB_N(mi), .CLOCK_100Hz(clock_100), .PB_SIN_REBOTE(nota[3]));
  ANTIREBOTE inst303 (.PB_N(fa), .CLOCK_100Hz(clock_100), .PB_SIN_REBOTE(nota[4]));
  ANTIREBOTE inst304 (.PB_N(sol), .CLOCK_100Hz(clock_100), .PB_SIN_REBOTE(nota[5]));
  ANTIREBOTE inst305 (.PB_N(la), .CLOCK_100Hz(clock_100), .PB_SIN_REBOTE(nota[6]));
  ANTIREBOTE inst306 (.PB_N(si), .CLOCK_100Hz(clock_100), .PB_SIN_REBOTE(nota[7]));
  or inst3 (OK[0], inst22_q, OK[2]);
  mux2_1 inst78 (.A(nota[1]), .B(Q[1]), .S(OK[1]), .Q(inst78_q));
  or inst140 (SOK, SW1[0], SW1[1]);
  referencia1 inst283 (.Salida(b21));
  mux2_1 inst75 (.A(nota[6]), .B(Q[6]), .S(OK[1]), .Q(inst75_q));
  mux2_1 inst77 (.A(nota[7]), .B(Q[7]), .S(OK[1]), .Q(inst77_q));
  mux2_1 inst2 (.A(nota[2]), .B(Q[2]), .S(OK[1]), .Q(inst2_q));
  mux2_1 inst74 (.A(nota[5]), .B(Q[5]), .S(OK[1]), .Q(inst74_q));
  and inst160 (inst160_out, encf, enc[6]);
  and inst162 (inst162_out, encf, enc[7]);
  mux2_1 inst20 (.A(nota[3]), .B(Q[3]), .S(OK[1]), .Q(inst20_q));
  mux2_1 inst47 (.A(nota[4]), .B(Q[4]), .S(OK[1]), .Q(inst47_q));
  referencia5 inst199 (.Salida(b5));
  referencia3 inst280 (.Salida(b3));
  comparador3 inst275 (.w1(b21), .w2(ADC[11:4]), .menor(inst275_menor));  // open: igual
  comparador3 inst268 (.w1(g22), .w2(ADC[11:4]), .menor(inst268_menor));  // open: igual
  comparador3 inst269 (.w1(b3), .w2(ADC[11:4]), .menor(inst269_menor));  // open: igual
  comparador3 inst270 (.w1(b4), .w2(ADC[11:4]), .menor(inst270_menor));  // open: igual
  comparador3 inst271 (.w1(b5), .w2(ADC[11:4]), .menor(inst271_menor));  // open: igual
  comparador3 inst272 (.w1(b6), .w2(ADC[11:4]), .menor(inst272_menor));  // open: igual
  comparador3 inst273 (.w1(b7), .w2(ADC[11:4]), .menor(inst273_menor));  // open: igual
  comparador3 inst274 (.w1(b8), .w2(ADC[11:4]), .menor(inst274_menor));  // open: igual
  and inst150 (inst150_out, encf, enc[1]);
  and inst152 (inst152_out, encf, enc[2]);
  and inst154 (inst154_out, encf, enc[3]);
  and inst156 (inst156_out, encf, enc[4]);
  and inst158 (inst158_out, encf, enc[5]);
  clk932Hz inst180 (.entrada(clock_1M), .reset(inst75_q), .salida(inst180_salida));
  clk988Hz inst185 (.entrada(clock_1M), .reset(inst77_q), .salida(inst185_salida));
  referencia7 inst207 (.Salida(b7));
  mux2_1 inst365 (.A(nota[0]), .B(1'b0), .S(OK[1]), .Q(inst365_q));
  clk880Hz inst179 (.entrada(clock_1M), .reset(inst75_q), .salida(inst179_salida));
  clk830Hz inst178 (.entrada(clock_1M), .reset(inst75_q), .salida(inst178_salida));
  registro_sostenimiento2_vhdl inst146 (
    .clock(clock_100), .reset(recf), .enable(inst160_out), .Ent(SW1), .Q(inst146_q));
  clk988Hz inst181 (.entrada(clock_1M), .reset(inst77_q), .salida(inst181_salida));
  clk932Hz inst186 (.entrada(clock_1M), .reset(inst77_q), .salida(inst186_salida));
  registro_sostenimiento2_vhdl inst147 (
    .clock(clock_100), .reset(recf), .enable(inst162_out), .Ent(SW1), .Q(inst147_q));
  mux2_1 inst (.A(1'b0), .B(1'b1), .S(START_n), .Q(inst_q));
  clk523Hz inst128 (.entrada(clock_1M), .reset(inst78_q), .salida(inst128_salida));
  clkdomHz inst151 (.entrada(clock_1M), .reset(inst78_q), .salida(inst151_salida));
  clkdososHz inst129 (.entrada(clock_1M), .reset(inst78_q), .salida(inst129_salida));
  registro_sostenimiento2_vhdl inst135 (
    .clock(clock_100), .reset(recf), .enable(inst150_out), .Ent(SW1), .Q(inst135_q));
  clk587Hz inst217 (.entrada(clock_1M), .reset(inst2_q), .salida(inst217_salida));
  clkdososHz inst153 (.entrada(clock_1M), .reset(inst2_q), .salida(inst153_salida));
  clk622Hz inst164 (.entrada(clock_1M), .reset(inst2_q), .salida(inst164_salida));
  registro_sostenimiento2_vhdl inst138 (
    .clock(clock_100), .reset(recf), .enable(inst152_out), .Ent(SW1), .Q(inst138_q));
  clk622Hz inst166 (.entrada(clock_1M), .reset(inst20_q), .salida(inst166_salida));
  clk675Hz inst170 (.entrada(clock_1M), .reset(inst20_q), .salida(inst170_salida));
  clk710Hz inst174 (.entrada(clock_1M), .reset(inst47_q), .salida(inst174_salida));
  clk739Hz inst173 (.entrada(clock_1M), .reset(inst47_q), .salida(inst173_salida));
  clk784Hz inst175 (.entrada(clock_1M), .reset(inst74_q), .salida(inst175_salida));
  clk739Hz inst176 (.entrada(clock_1M), .reset(inst74_q), .salida(inst176_salida));
  clk830Hz inst177 (.entrada(clock_1M), .reset(inst74_q), .salida(inst177_salida));
  registro_sostenimiento2_vhdl inst144 (
    .clock(clock_100), .reset(recf), .enable(inst158_out), .Ent(SW1), .Q(inst144_q));
  referencia2 inst278 (.Salida(g22));
  clk659Hz inst167 (.entrada(clock_1M), .reset(inst20_q), .salida(inst167_salida));
  registro_sostenimiento2_vhdl inst139 (
    .clock(clock_100), .reset(recf), .enable(inst154_out), .Ent(SW1), .Q(inst139_q));
  clk698Hz inst171 (.entrada(clock_1M), .reset(inst47_q), .salida(inst171_salida));
  registro_sostenimiento2_vhdl inst141 (
    .clock(clock_100), .reset(recf), .enable(inst156_out), .Ent(SW1), .Q(inst141_q));
  clk523Hz inst340 (.entrada(clock_1M), .reset(inst365_q), .salida(freq[0]));
  mux4_2 inst213 (
    .A(inst179_salida), .B(inst178_salida), .C(inst180_salida), .D(inst179_salida), .S(inst146_q), .Q(freq[6]));
  mux4_2 inst133 (
    .A(inst181_salida), .B(inst186_salida), .C(inst185_salida), .D(inst181_salida), .S(inst147_q), .Q(freq[7]));
  referencia4 inst281 (.Salida(b4));
  registro_sostenimiento_1_vhdl inst299 (
    .clock(clock10k), .reset(inst_q), .enable(inst275_menor), .Ent(1'b1), .Q(o_adc_data[0]));
  registro_sostenimiento_1_vhdl inst292 (
    .clock(clock10k), .reset(inst_q), .enable(inst268_menor), .Ent(1'b1), .Q(o_adc_data[1]));
  registro_sostenimiento_1_vhdl inst294 (
    .clock(clock10k), .reset(inst_q), .enable(inst269_menor), .Ent(1'b1), .Q(o_adc_data[2]));
  registro_sostenimiento_1_vhdl inst293 (
    .clock(clock10k), .reset(inst_q), .enable(inst270_menor), .Ent(1'b1), .Q(o_adc_data[3]));
  registro_sostenimiento_1_vhdl inst295 (
    .clock(clock10k), .reset(inst_q), .enable(inst271_menor), .Ent(1'b1), .Q(o_adc_data[4]));
  registro_sostenimiento_1_vhdl inst296 (
    .clock(clock10k), .reset(inst_q), .enable(inst272_menor), .Ent(1'b1), .Q(o_adc_data[5]));
  registro_sostenimiento_1_vhdl inst297 (
    .clock(clock10k), .reset(inst_q), .enable(inst273_menor), .Ent(1'b1), .Q(o_adc_data[6]));
  registro_sostenimiento_1_vhdl inst298 (
    .clock(clock10k), .reset(inst_q), .enable(inst274_menor), .Ent(1'b1), .Q(o_adc_data[7]));
  or inst288 (inst288_out, o_adc_data[0], o_adc_data[1], o_adc_data[2], o_adc_data[3], o_adc_data[4], o_adc_data[5], o_adc_data[6], o_adc_data[7]);
  mux4_2 inst131 (
    .A(inst128_salida), .B(inst151_salida), .C(inst129_salida), .D(inst128_salida), .S(inst135_q), .Q(freq[1]));
  mux4_2 inst208 (
    .A(inst217_salida), .B(inst153_salida), .C(inst164_salida), .D(inst217_salida), .S(inst138_q), .Q(freq[2]));
  mux4_2 inst209 (
    .A(inst167_salida), .B(inst166_salida), .C(inst170_salida), .D(inst167_salida), .S(inst139_q), .Q(freq[3]));
  mux4_2 inst211 (
    .A(inst171_salida), .B(inst174_salida), .C(inst173_salida), .D(inst171_salida), .S(inst141_q), .Q(freq[4]));
  mux4_2 inst212 (
    .A(inst175_salida), .B(inst176_salida), .C(inst177_salida), .D(inst175_salida), .S(inst144_q), .Q(freq[5]));
  referencia8 inst214 (.Salida(b8));
  referencia6 inst206 (.Salida(b6));
  clk5Hz inst328 (.entrada(clock_1M), .reset(1'b1), .salida(fr[2]));
  clk3Hz inst317 (.entrada(clock_1M), .reset(1'b1), .salida(inst317_salida));
  clk1Hz inst316 (.entrada(clock_1M), .reset(1'b1), .salida(fr[6]));
  clk05Hz inst192 (.entrada(clock_1M), .reset(1'b1), .salida(fr[7]));
  clk7Hz inst329 (.entrada(clock_1M), .reset(1'b1), .salida(inst329_salida));
  clk4Hz inst319 (.entrada(clock_1M), .reset(1'b1), .salida(inst319_salida));
  clk2Hz inst318 (.entrada(clock_1M), .reset(1'b1), .salida(inst318_salida));
  ANTIREBOTE inst388 (.PB_N(CA0), .CLOCK_100Hz(clock_100), .PB_SIN_REBOTE(C[0]));
  ANTIREBOTE inst389 (.PB_N(CA7), .CLOCK_100Hz(clock_100), .PB_SIN_REBOTE(C[7]));
  ANTIREBOTE inst307 (.PB_N(CA1), .CLOCK_100Hz(clock_100), .PB_SIN_REBOTE(C[1]));
  ANTIREBOTE inst308 (.PB_N(CA2), .CLOCK_100Hz(clock_100), .PB_SIN_REBOTE(C[2]));
  ANTIREBOTE inst309 (.PB_N(CA3), .CLOCK_100Hz(clock_100), .PB_SIN_REBOTE(C[3]));
  ANTIREBOTE inst310 (.PB_N(CA4), .CLOCK_100Hz(clock_100), .PB_SIN_REBOTE(C[4]));
  ANTIREBOTE inst311 (.PB_N(CA5), .CLOCK_100Hz(clock_100), .PB_SIN_REBOTE(C[5]));
  ANTIREBOTE inst312 (.PB_N(CA6), .CLOCK_100Hz(clock_100), .PB_SIN_REBOTE(C[6]));
  encoder_De inst248 (.Ent(o_adc_data[7:0]), .Salida(inst248_salida));
  or inst92 (inst92_out, STOP, GUARDAR_n);
  mux8 inst249 (
    .A(clock_1), .B(inst329_salida), .C(fr[2]), .D(inst319_salida), .E(inst317_salida), .F(inst318_salida),
    .G(fr[6]), .H(fr[7]), .S(inst248_salida), .Q(clock_repro));
  registro_sostenimiento_1_vhdl inst35 (.clock(clock_100), .reset(reset_sos4), .enable(en_M1), .Ent(1'b1), .Q(M1[1]));
  registro_sostenimiento_1_vhdl inst39 (.clock(clock_100), .reset(reset_sos5), .enable(en_M2), .Ent(1'b1), .Q(M2[1]));
  registro_sostenimiento_1_vhdl inst43 (.clock(clock_100), .reset(reset_sos6), .enable(en_M3), .Ent(1'b1), .Q(M3[1]));
  registro_sostenimiento_1_vhdl inst37 (.clock(clock_100), .reset(reset_sos7), .enable(en_M4), .Ent(1'b1), .Q(M4[1]));
  registro_sostenimiento_1_vhdl inst41 (.clock(clock_100), .reset(reset_sos8), .enable(en_M5), .Ent(1'b1), .Q(M5[1]));
  registro_sostenimiento_1_vhdl inst45 (.clock(clock_100), .reset(reset_sos9), .enable(en_M6), .Ent(1'b1), .Q(M6[1]));
  or inst95 (inst95_out, STOP, GUARDAR_n);
  or inst97 (inst97_out, STOP, GUARDAR_n);
  or inst99 (inst99_out, STOP, GUARDAR_n);
  or inst222 (inst222_out, STOP, GUARDAR_n);
  or inst216 (inst216_out, STOP, GUARDAR_n);
  and inst91 (en_reg1, M1[1], inst92_out);
  and inst96 (en_reg3, M3[1], inst97_out);
  and inst98 (en_reg4, M4[1], inst99_out);
  and inst221 (en_reg5, M5[1], inst222_out);
  and inst224 (en_reg6, M6[1], inst216_out);
  MSS_PIANO inst48 (
    .clock(clock_100), .reset(RESET_n), .start(START_n), .modo_practica(PRACTICA), .regresar(REGRESAR),
    .modo_melodia(melodia), .guardar_n(GUARDAR_n), .stop(STOP), .modo_reproduccion(reproducir),
    .or_melodia(OR_MELODIA), .SOK(SOK), .max(MAX), .rt_s1(reset_sos1), .rt_s2(reset_sos2),
    .rt_s3(reset_sos3), .rt_s4(reset_sos4), .rt_s5(reset_sos5), .rt_s6(reset_sos6), .rt_s7(reset_sos7),
    .rt_s8(reset_sos8), .rt_s9(reset_sos9), .rt_s10(reset_sos10), .rt_s11(reset_sos11), .rt_s12(reset_sos12),
    .rt_s13(reset_sos13), .rt_s14(reset_sos14), .rt_s15(reset_sos15), .rt_s16(reset_sos16),
    .rt_s17(reset_sos17), .rt_s18(reset_sos18), .rt_s19(reset_sos19), .rt_s20(reset_sos20),
    .rt_s21(reset_sos21), .encf(encf), .recf(recf), .rt_60(reset_60), .en_cnt(en_cnt), .repro(repro),
    .salida_estado(ESTADO));
  encoder_Dec_BCD_M inst245 (.Ent(C), .Salida(inst245_salida));
  and inst94 (en_reg2, M2[1], inst95_out);
  Cont inst125 (.Clk(clock_1k), .Q(inst125_q));
  bcda7 inst246 (.BCD(inst245_salida), .SEG7(SEG));
  registro_sostenimiento_1_vhdl inst223 (.clock(clock_100), .reset(reset_sos20), .enable(en_L1), .Ent(1'b1), .Q(M1[0]));
  registro_sostenimiento_1_vhdl inst277 (.clock(clock_100), .reset(reset_sos16), .enable(en_L2), .Ent(1'b1), .Q(M2[0]));
  registro_sostenimiento_1_vhdl inst111 (.clock(clock_100), .reset(reset_sos17), .enable(en_L3), .Ent(1'b1), .Q(M3[0]));
  registro_sostenimiento_1_vhdl inst370 (.clock(clock_100), .reset(reset_sos21), .enable(en_L4), .Ent(1'b1), .Q(M4[0]));
  registro_sostenimiento_1_vhdl inst279 (.clock(clock_100), .reset(reset_sos18), .enable(en_L5), .Ent(1'b1), .Q(M5[0]));
  registro_sostenimiento_1_vhdl inst113 (.clock(clock_100), .reset(reset_sos19), .enable(en_L6), .Ent(1'b1), .Q(M6[0]));
  mux21_1 inst143 (.A(s_nota), .B(F), .S(OK[1]), .Q(inst143_q));
  anillo inst124 (.Entrada(inst125_q), .Salida(COLUMNAS));
  registro_sostenimiento_vhdl inst105 (
    .clock(clock_100), .reset(reset_sos15), .enable(en_reg1), .Ent(Add_RAM), .Q(Add_MAX1));
  registro_sostenimiento_vhdl inst106 (
    .clock(clock_100), .reset(reset_sos10), .enable(en_reg2), .Ent(Add_RAM), .Q(Add_MAX2));
  registro_sostenimiento_vhdl inst107 (
    .clock(clock_100), .reset(reset_sos11), .enable(en_reg3), .Ent(Add_RAM), .Q(Add_MAX3));
  registro_sostenimiento_vhdl inst108 (
    .clock(clock_100), .reset(reset_sos12), .enable(en_reg4), .Ent(Add_RAM), .Q(Add_MAX4));
  registro_sostenimiento_vhdl inst109 (
    .clock(clock_100), .reset(reset_sos13), .enable(en_reg5), .Ent(Add_RAM), .Q(Add_MAX5));
  registro_sostenimiento_vhdl inst110 (
    .clock(clock_100), .reset(reset_sos14), .enable(en_reg6), .Ent(Add_RAM), .Q(Add_MAX6));
  Memoria inst126 (.Selector_letra(inst143_q), .Direccion(COLUMNAS), .Datos(FILAS));
  or inst90 (clock_pulso, nota[0], nota[1], nota[2], nota[3], nota[4], nota[5], nota[6], nota[7]);
  or inst122 (cnt, clock_pulso, en_cnt);
  mux4_2 inst49 (.A(1'b0), .B(1'b0), .C(clock_pulso), .D(1'b0), .S(M1), .Q(MODO1));
  mux4_2 inst54 (.A(1'b0), .B(1'b0), .C(clock_pulso), .D(1'b0), .S(M2), .Q(MODO2));
  mux4_2 inst57 (.A(1'b0), .B(1'b0), .C(clock_pulso), .D(1'b0), .S(M3), .Q(MODO3));
  mux4_2 inst60 (.A(1'b0), .B(1'b0), .C(clock_pulso), .D(1'b0), .S(M4), .Q(MODO4));
  mux4_2 inst63 (.A(1'b0), .B(1'b0), .C(clock_pulso), .D(1'b0), .S(M5), .Q(MODO5));
  mux4_2 inst66 (.A(1'b0), .B(1'b0), .C(clock_pulso), .D(1'b0), .S(M6), .Q(MODO6));
  comparador_vhdl inst200 (.w1(Add_RAM), .w2(Add_MAX1), .igual(inst200_igual));  // open: menor
  comparador_vhdl inst201 (.w1(Add_RAM), .w2(Add_MAX2), .igual(inst201_igual));  // open: menor
  comparador_vhdl inst202 (.w1(Add_RAM), .w2(Add_MAX3), .igual(inst202_igual));  // open: menor
  comparador_vhdl inst203 (.w1(Add_RAM), .w2(Add_MAX4), .igual(inst203_igual));  // open: menor
  comparador_vhdl inst204 (.w1(Add_RAM), .w2(Add_MAX5), .igual(inst204_igual));  // open: menor
  comparador_vhdl inst205 (.w1(Add_RAM), .w2(Add_MAX6), .igual(inst205_igual));  // open: menor
  encoder_Dec_BCD_2 inst12 (.Ent(nota), .Salida(s_nota));
  mux_8a1 #(.n(8)) inst17 (.DIN(freq), .SEL(s_nota), .DOUT(salida1));
  mux4_2 inst18 (.A(1'b0), .B(salida1), .C(r), .D(1'b0), .S(OK[1:0]), .Q(PARLANTE));
  or inst215 (MAX, MAX1, MAX2, MAX3, MAX4, MAX5, MAX6);
  and inst7 (MAX1, M1[0], inst200_igual);
  and inst8 (MAX2, M2[0], inst201_igual);
  and inst9 (MAX3, M3[0], inst202_igual);
  and inst10 (MAX4, M4[0], inst203_igual);
  and inst11 (MAX5, M5[0], inst204_igual);
  and inst13 (MAX6, M6[0], inst205_igual);
  mux2_1 inst16 (.A(clock_pulso), .B(clock_repro), .S(OK[1]), .Q(clockr));
  registro_sostenimiento_1_vhdl inst5 (.clock(clock_100), .reset(reset_60), .enable(cnt), .Ent(1'b1), .Q(cnt_1));
  contador_60seg inst27 (.clock(clockr), .enable(cnt_1), .reset(reset_60), .Q(Add_RAM));  // open: sesenta_seg
  comparador_vhdl inst391 (.w1(Add_RAM), .w2(6'b111100), .igual(STOP));  // open: menor
  and inst29 (en_M1, C[1], OK[2]);
  and inst31 (en_M2, C[2], OK[2]);
  and inst33 (en_M3, C[3], OK[2]);
  and inst30 (en_M4, C[4], OK[2]);
  and inst32 (en_M5, C[5], OK[2]);
  and inst34 (en_M6, C[6], OK[2]);
  or inst28 (OR_MELODIA, C[1], C[2], C[3], C[4], C[5], C[6]);
  and inst67 (en_L1, C[1], OK[1]);
  and inst69 (en_L2, C[2], OK[1]);
  and inst71 (en_L3, C[3], OK[1]);
  and inst68 (en_L4, C[4], OK[1]);
  and inst70 (en_L5, C[5], OK[1]);
  and inst72 (en_L6, C[6], OK[1]);
  RAMMELO inst85 (.data(s_nota), .wren(MODO1), .address(Add_RAM), .clock(clockr), .q(QRAM_1));
  RAMMELO inst80 (.data(s_nota), .wren(MODO2), .address(Add_RAM), .clock(clockr), .q(QRAM_2));
  RAMMELO inst81 (.data(s_nota), .wren(MODO3), .address(Add_RAM), .clock(clockr), .q(QRAM_3));
  RAMMELO inst82 (.data(s_nota), .wren(MODO4), .address(Add_RAM), .clock(clockr), .q(QRAM_4));
  RAMMELO inst83 (.data(s_nota), .wren(MODO5), .address(Add_RAM), .clock(clockr), .q(QRAM_5));
  RAMMELO inst84 (.data(s_nota), .wren(MODO6), .address(Add_RAM), .clock(clockr), .q(QRAM_6));
  mux_8a1 #(.n(8)) inst115 (.DIN(freq), .SEL(F), .DOUT(r));
  or inst196 (F[0], QRAM_1[0], QRAM_2[0], QRAM_3[0], QRAM_4[0], QRAM_5[0], QRAM_6[0]);
  or inst184 (F[1], QRAM_1[1], QRAM_2[1], QRAM_3[1], QRAM_4[1], QRAM_5[1], QRAM_6[1]);
  or inst134 (F[2], QRAM_1[2], QRAM_2[2], QRAM_3[2], QRAM_4[2], QRAM_5[2], QRAM_6[2]);
  decoder_de_3_a_8 inst330 (.A(F[0]), .B(F[1]), .C(F[2]), .Q(Q));

  assign o_adc_data[11:8] = 4'b1111;

  // Other names for the same wires on the sheet: l[7:0] = o_adc_data[7:0]

  // Notes on the sheet:
  //   cambiador de tonos
  //   matriz de puntos 8x8
endmodule
